# EAGLE design SmartWatch_System (EAGLE 9.7.0)
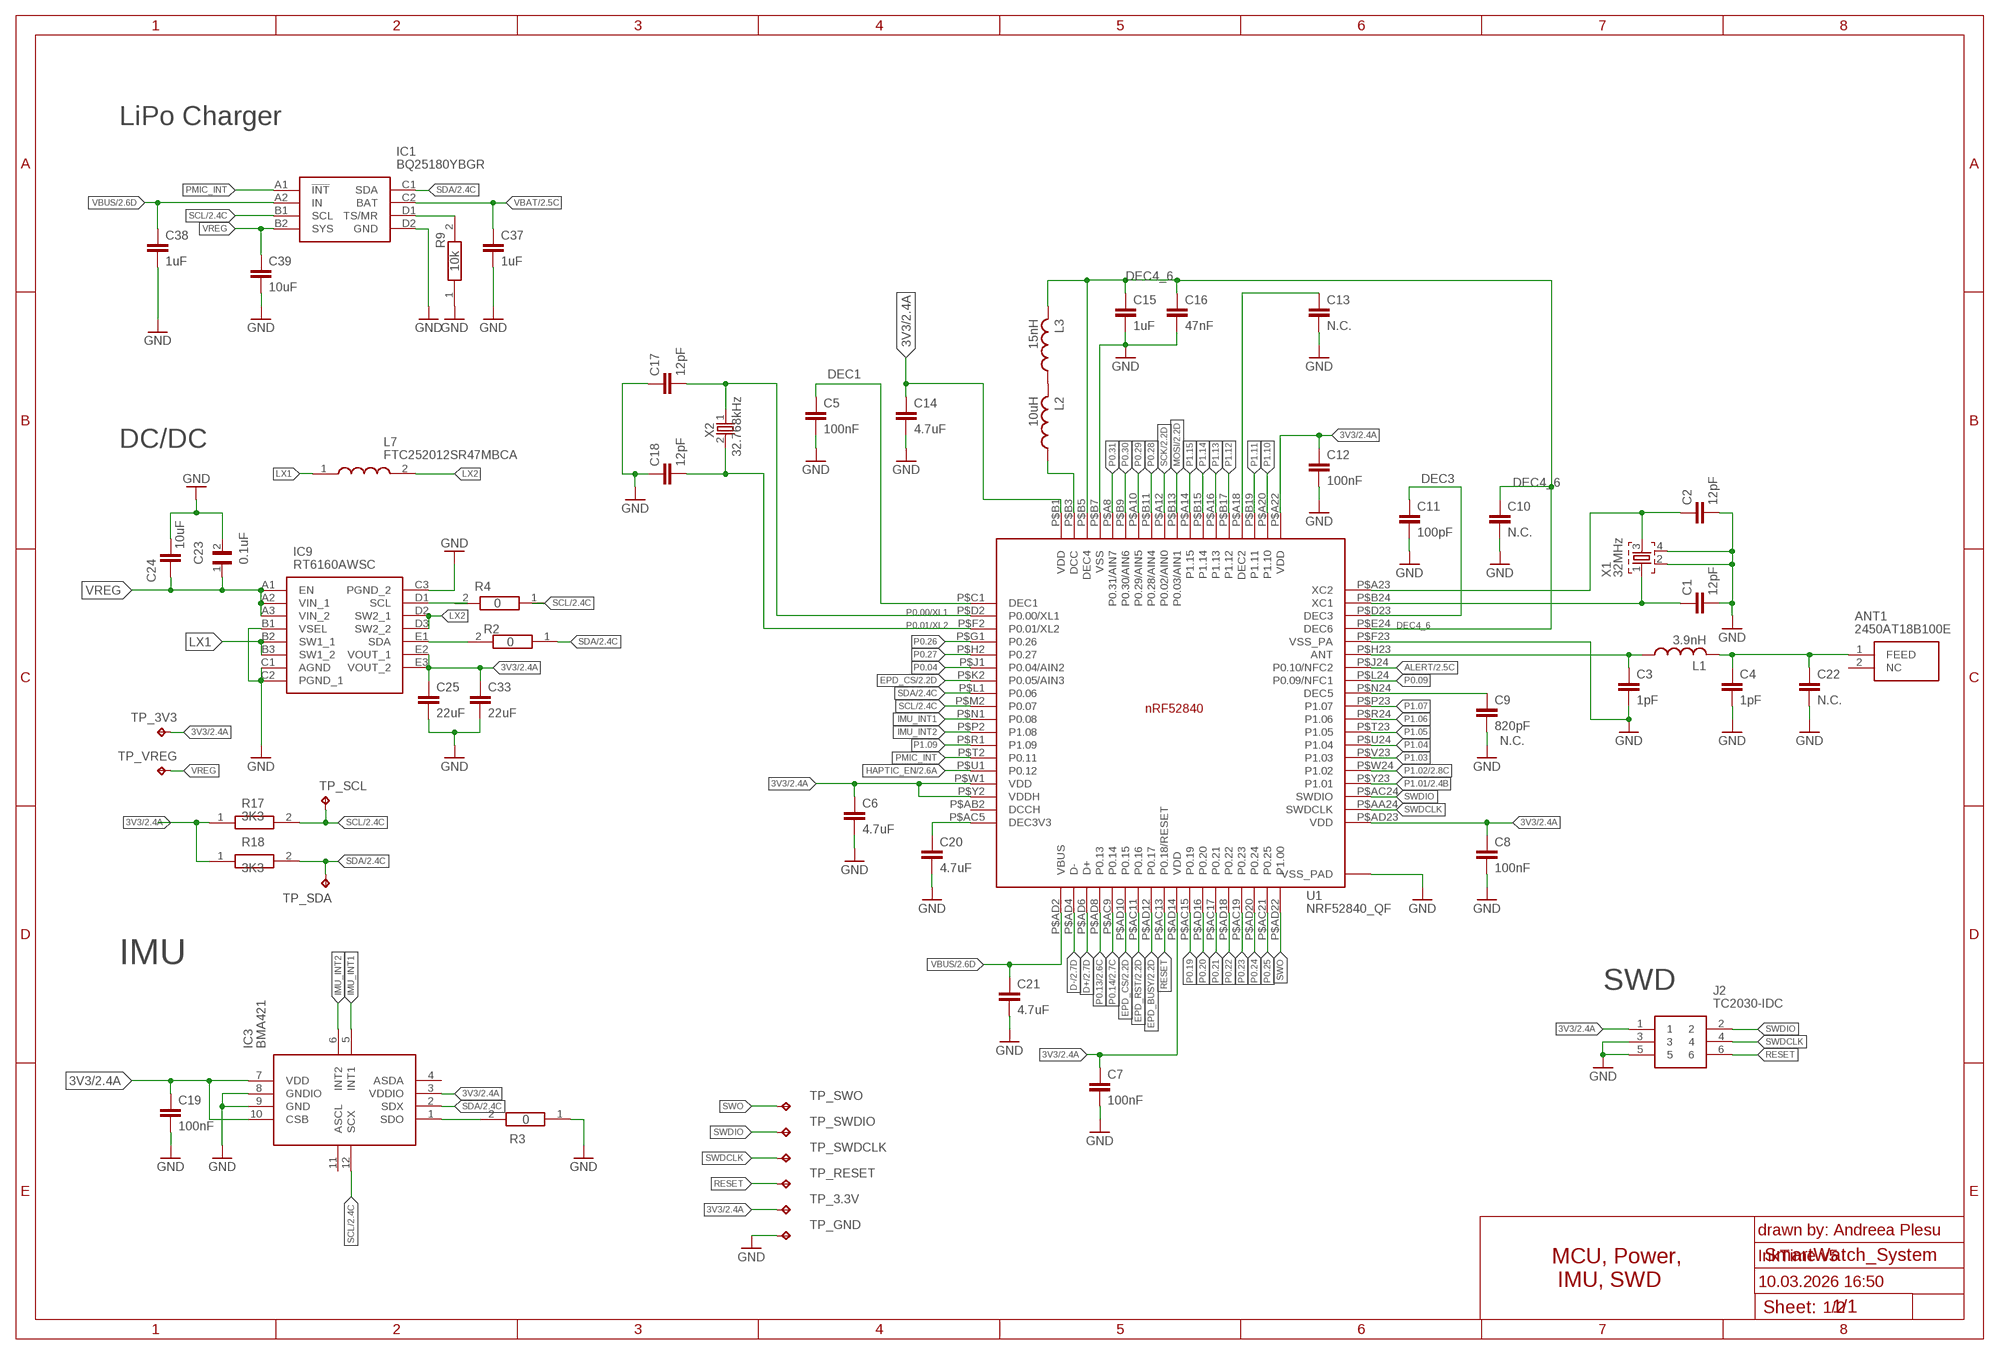
[diagram p0: schematic, sheet 1, part 1 of 2]
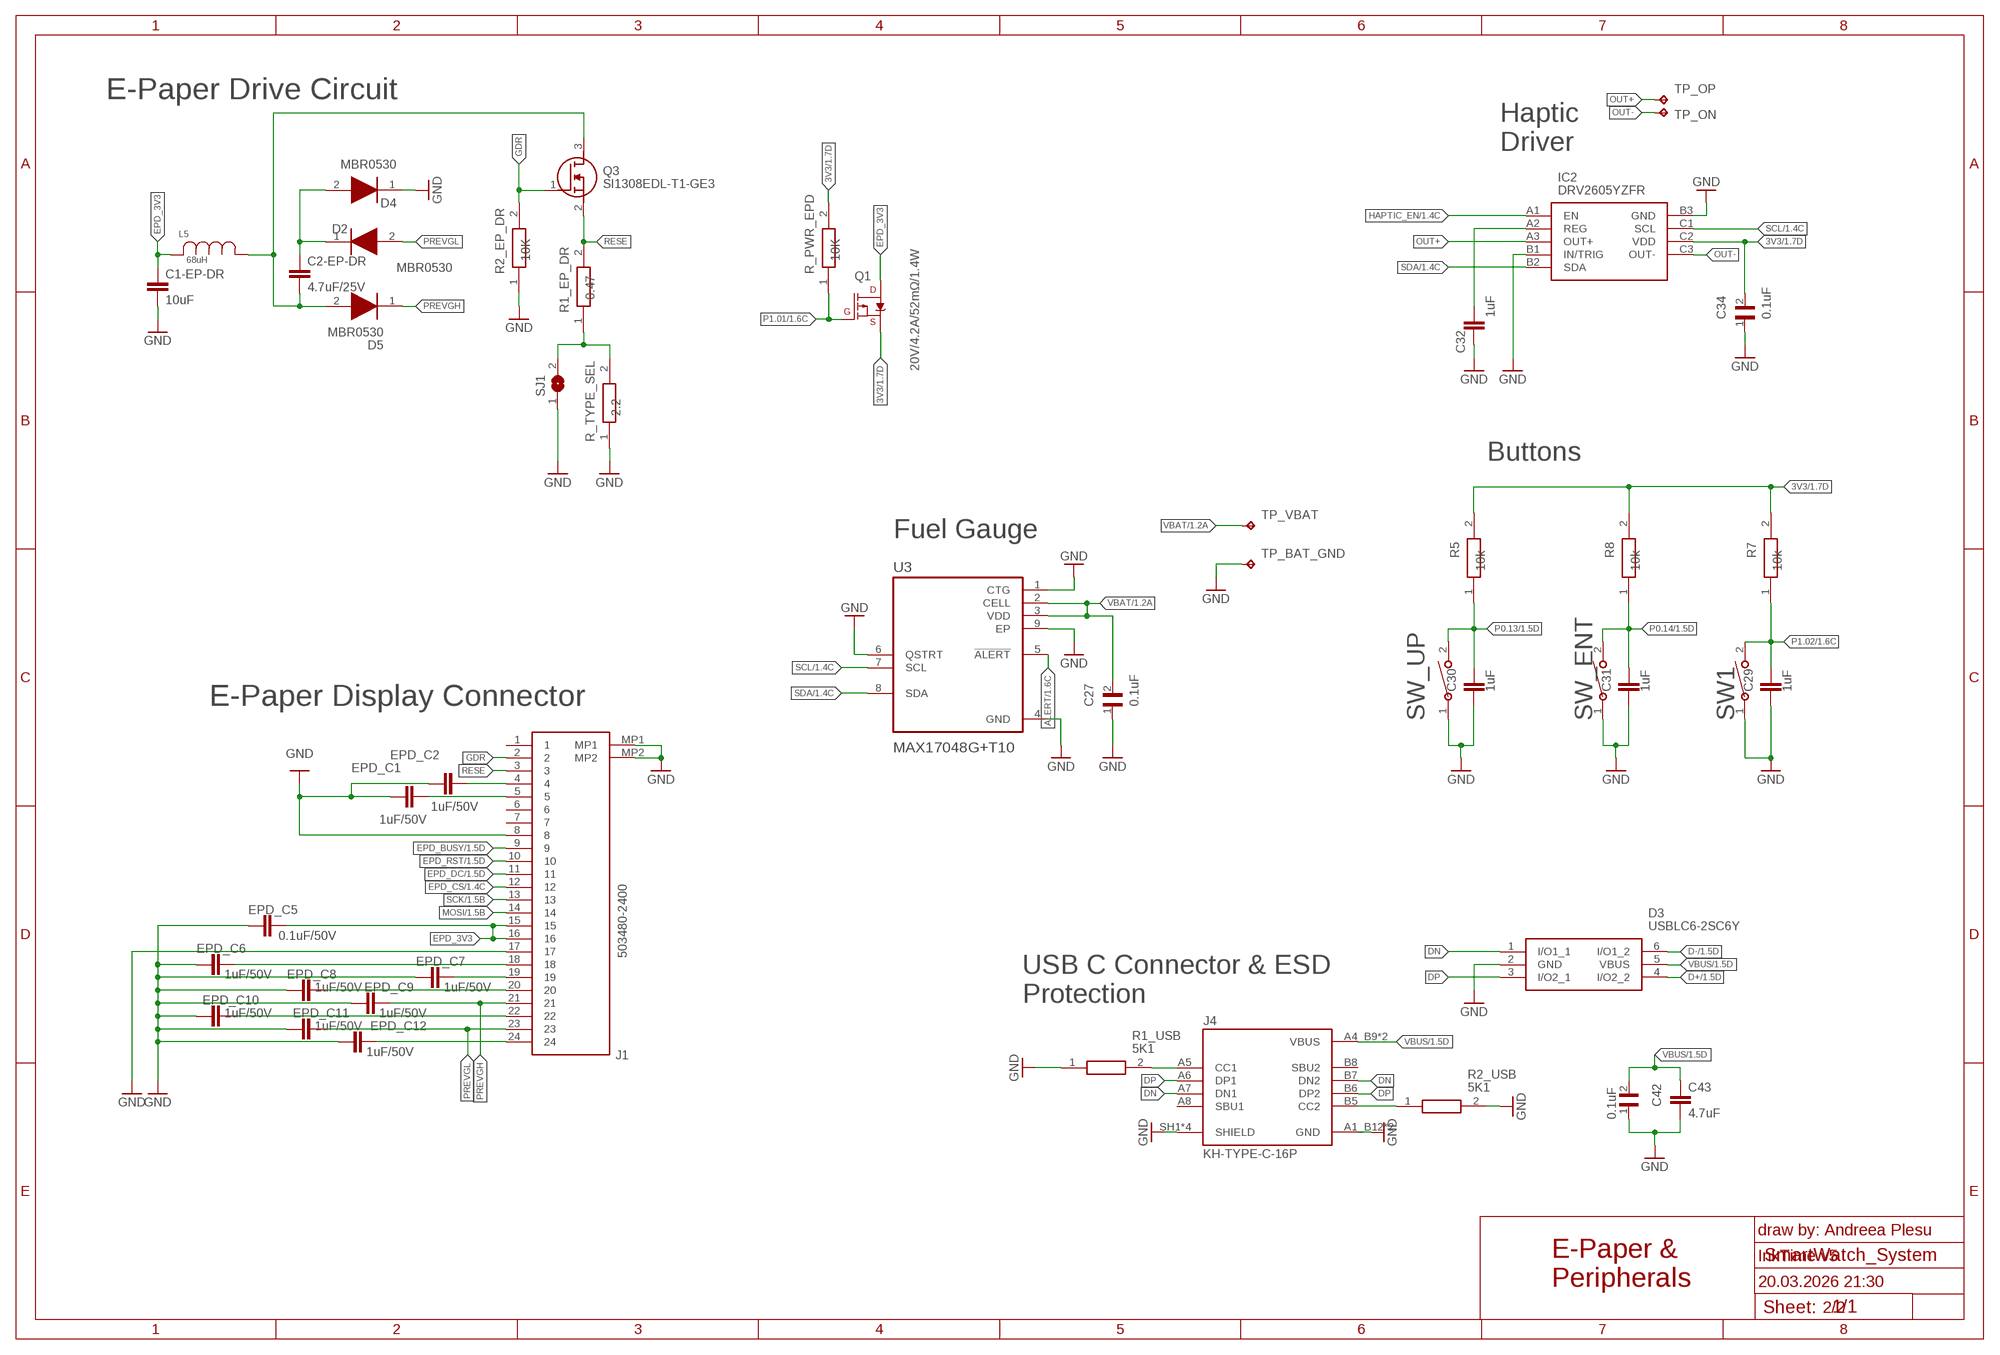
[diagram p1: schematic, sheet 1, part 2 of 2]

## Parts
ANT1  2450AT18B100E  2450AT18B100E_2450AT18B100E  [2450AT18B100E_ANTC3216X140N]
C1  12pF  NORDIC_NRF_3_CAPACITOR_0201_L  [NORDIC_NRF_3_RESC0201_L]
C1-EP-DR  10uF  NORDIC_NRF_3_CAPACITOR_0402_L  [NORDIC_NRF_3_RESC0402_L]
C2  12pF  NORDIC_NRF_3_CAPACITOR_0201_L  [NORDIC_NRF_3_RESC0201_L]
C2-EP-DR  4.7uF/25V  NORDIC_NRF_3_CAPACITOR_0402_L  [NORDIC_NRF_3_RESC0402_L]
C3  1pF  NORDIC_NRF_3_CAPACITOR_0201_L  [NORDIC_NRF_3_RESC0201_L]
C4  1pF  NORDIC_NRF_3_CAPACITOR_0201_L  [NORDIC_NRF_3_RESC0201_L]
C5  100nF  NORDIC_NRF_3_CAPACITOR_0201_L  [NORDIC_NRF_3_RESC0201_L]
C6  4.7uF  NORDIC_NRF_3_CAPACITOR_0402_L  [NORDIC_NRF_3_RESC0402_L]
C7  100nF  NORDIC_NRF_3_CAPACITOR_0201_L  [NORDIC_NRF_3_RESC0201_L]
C8  100nF  NORDIC_NRF_3_CAPACITOR_0201_L  [NORDIC_NRF_3_RESC0201_L]
C9  820pF  NORDIC_NRF_3_CAPACITOR_0201_L  [NORDIC_NRF_3_RESC0201_L]
C10  N.C.  NORDIC_NRF_3_CAPACITOR_0201_L  [NORDIC_NRF_3_RESC0201_L]
C11  100pF  NORDIC_NRF_3_CAPACITOR_0201_L  [NORDIC_NRF_3_RESC0201_L]
C12  100nF  NORDIC_NRF_3_CAPACITOR_0201_L  [NORDIC_NRF_3_RESC0201_L]
C13  N.C.  NORDIC_NRF_3_CAPACITOR_0201_L  [NORDIC_NRF_3_RESC0201_L]
C14  4.7uF  PERFECT_0402_CAP_0402  [PERFECT_0402_0402]
C15  1uF  PERFECT_0402_CAP_0402  [PERFECT_0402_0402]
C16  47nF  NORDIC_NRF_3_CAPACITOR_0201_L  [NORDIC_NRF_3_RESC0201_L]
C17  12pF  NORDIC_NRF_3_CAPACITOR_0201_L  [NORDIC_NRF_3_RESC0201_L]
C18  12pF  NORDIC_NRF_3_CAPACITOR_0201_L  [NORDIC_NRF_3_RESC0201_L]
C19  100nF  NORDIC_NRF_3_CAPACITOR_0201_L  [NORDIC_NRF_3_RESC0201_L]
C20  4.7uF  NORDIC_NRF_3_CAPACITOR_0402_L  [NORDIC_NRF_3_RESC0402_L]
C21  4.7uF  NORDIC_NRF_3_CAPACITOR_0402_L  [NORDIC_NRF_3_RESC0402_L]
C22  N.C.  NORDIC_NRF_3_CAPACITOR_0201_L  [NORDIC_NRF_3_RESC0201_L]
C23  0.1uF  GRM011R60J152KE01L_2_GRM011R60J152KE01L  [GRM011R60J152KE01L_2_CAPC0201X13N]
C24  10uF  PERFECT_0402_CAP_0402  [PERFECT_0402_0402]
C25  22uF  NORDIC_NRF_3_CAPACITOR_0402_L  [NORDIC_NRF_3_RESC0402_L]
C27  0.1uF  GRM011R60J152KE01L_2_GRM011R60J152KE01L  [GRM011R60J152KE01L_2_CAPC0201X13N]
C29  1uF  PERFECT_0402_CAP_0402  [PERFECT_0402_0402]
C30  1uF  PERFECT_0402_CAP_0402  [PERFECT_0402_0402]
C31  1uF  PERFECT_0402_CAP_0402  [PERFECT_0402_0402]
C32  1uF  NORDIC_NRF_3_CAPACITOR_0402_L  [NORDIC_NRF_3_RESC0402_L]
C33  22uF  NORDIC_NRF_3_CAPACITOR_0402_L  [NORDIC_NRF_3_RESC0402_L]
C34  0.1uF  GRM011R60J152KE01L_1_GRM011R60J152KE01L  [NORDIC_NRF_3_RESC0201_L]
C37  1uF  PERFECT_0402_CAP_0402  [PERFECT_0402_0402]
C38  1uF  PERFECT_0402_CAP_0402  [PERFECT_0402_0402]
C39  10uF  PERFECT_0402_CAP_0402  [PERFECT_0402_0402]
C42  0.1uF  GRM011R60J152KE01L_1_GRM011R60J152KE01L  [NORDIC_NRF_3_RESC0201_L]
C43  4.7uF  PERFECT_0402_CAP_0402  [PERFECT_0402_0402]
D2  MBR0530  ESP32_C6_LIBRARY_5_MBR0530  [ESP32_C6_LIBRARY_5_SOD3716X135N]
D3  USBLC6-2SC6Y  ESP32_C6_LIBRARY_3_USBLC6-2SC6Y  [ESP32_C6_LIBRARY_3_SOT95P280X145-6N]
D4  MBR0530  ESP32_C6_LIBRARY_5_MBR0530  [ESP32_C6_LIBRARY_5_SOD3716X135N]
D5  MBR0530  ESP32_C6_LIBRARY_5_MBR0530  [ESP32_C6_LIBRARY_5_SOD3716X135N]
EPD_C1  1uF/50V  NORDIC_NRF_3_CAPACITOR_0402_L  [NORDIC_NRF_3_RESC0402_L]
EPD_C2  1uF/50V  NORDIC_NRF_3_CAPACITOR_0402_L  [NORDIC_NRF_3_RESC0402_L]
EPD_C5  0.1uF/50V  NORDIC_NRF_3_CAPACITOR_0201_L  [NORDIC_NRF_3_RESC0201_L]
EPD_C6  1uF/50V  NORDIC_NRF_3_CAPACITOR_0402_L  [NORDIC_NRF_3_RESC0402_L]
EPD_C7  1uF/50V  NORDIC_NRF_3_CAPACITOR_0402_L  [NORDIC_NRF_3_RESC0402_L]
EPD_C8  1uF/50V  NORDIC_NRF_3_CAPACITOR_0402_L  [NORDIC_NRF_3_RESC0402_L]
EPD_C9  1uF/50V  NORDIC_NRF_3_CAPACITOR_0402_L  [NORDIC_NRF_3_RESC0402_L]
EPD_C10  1uF/50V  NORDIC_NRF_3_CAPACITOR_0402_L  [NORDIC_NRF_3_RESC0402_L]
EPD_C11  1uF/50V  NORDIC_NRF_3_CAPACITOR_0402_L  [NORDIC_NRF_3_RESC0402_L]
EPD_C12  1uF/50V  NORDIC_NRF_3_CAPACITOR_0402_L  [NORDIC_NRF_3_RESC0402_L]
IC1  BQ25180YBGR  BQ25180YBGR_BQ25180YBGR  [BQ25180YBGR_BGA8C40P2X4_100X155X50]
IC2  DRV2605YZFR  DRV2605YZFR_DRV2605YZFR  [DRV2605YZFR_BGA9C50P3X3_144X144X62]
IC3  BMA421  BMA423_BMA423  [BMA423_BMA423]
IC9  RT6160AWSC  RT6160AWSC_RT6160AWSC  [RT6160AWSC_BGA15C40P3X5_140X230X60]
J1  503480-2400  503480-2400_503480-2400  [503480-2400_5034802400]
J2  TC2030-IDC  TC2030-IDC_TC2030-IDC  [TC2030-IDC_TC2030IDC]
J4  KH-TYPE-C-16P  KH-TYPE-C-16P_KH-TYPE-C-16P  [KH-TYPE-C-16P_KINGHELM_KH-TYPE-C-16P]
L1  3.9nH  NORDIC_NRF_2_INDUCTOR_0402_L  [NORDIC_NRF_2_RESC0402_L]
L2  10uH  NORDIC_NRF_2_INDUCTOR_0402_L  [NORDIC_NRF_2_RESC0402_L]
L3  15nH  NORDIC_NRF_2_INDUCTOR_0402_L  [NORDIC_NRF_2_RESC0402_L]
L5  68uH  ESP32_C6_LIBRARY_2_744043680IND_4828-WE-TPC_WRE  [ESP32_C6_LIBRARY_2_IND_4828-WE-TPC_WRE]
L7  FTC252012SR47MBCA  MLP2016SR47MT0S1_FTC252012SR47MBCA  [MLP2016SR47MT0S1_INDC2016X100N]
Q1  20V/4.2A/52mΩ/1.4W  ESP32_C6_LIBRARY_4_ESP32_WROVER_SPARKFUN-DISCRETESEMI_MOSFET_PCH-DMG2305UX-7  [ESP32_C6_LIBRARY_4_ESP32_C6_LIBRARY_4_ESP32_C6_LIBRARY_4_ESP32_C6_LIBRARY_4_ESP32_WROVER_SPARKFUN-DISCRETESEMI_SOT23-3]
Q3  SI1308EDL-T1-GE3  ESP32_C6_LIBRARY_6_SI1308EDL-T1-GE3  [ESP32_C6_LIBRARY_6_SOT65P210X110-3N]
R1_EP_DR  0.47  CPF0201D7K68C1_CPF0201D7K68C1  [CPF0201D7K68C1_0201]
R1_USB  5K1  CPF0201D7K68C1_CPF0201D7K68C1  [CPF0201D7K68C1_0201]
R2  0  ERA-1AEB3401C_CPF0201D7K68C1  [ERA-1AEB3401C_0201]
R2_EP_DR  10K  CPF0201D7K68C1_CPF0201D7K68C1  [CPF0201D7K68C1_0201]
R2_USB  5K1  CPF0201D7K68C1_CPF0201D7K68C1  [CPF0201D7K68C1_0201]
R3  0  CPF0201D7K68C1_CPF0201D7K68C1  [CPF0201D7K68C1_0201]
R4  0  ERA-1AEB3401C_CPF0201D7K68C1  [ERA-1AEB3401C_0201]
R5  10k  CPF0201D7K68C1_CPF0201D7K68C1  [CPF0201D7K68C1_0201]
R7  10k  CPF0201D7K68C1_CPF0201D7K68C1  [CPF0201D7K68C1_0201]
R8  10k  CPF0201D7K68C1_CPF0201D7K68C1  [CPF0201D7K68C1_0201]
R9  10k  ERA-1AEB3401C_CPF0201D7K68C1  [ERA-1AEB3401C_0201]
R17  3K3  ERA-1AEB3401C_CPF0201D7K68C1  [ERA-1AEB3401C_0201]
R18  3K3  ERA-1AEB3401C_CPF0201D7K68C1  [ERA-1AEB3401C_0201]
R_PWR_EPD  10K  CPF0201D7K68C1_CPF0201D7K68C1  [CPF0201D7K68C1_0201]
R_TYPE_SEL  2.2  CPF0201D7K68C1_CPF0201D7K68C1  [CPF0201D7K68C1_0201]
SJ1  ESP32_C6_LIBRARY_7_JUMPER_SJ  [ESP32_C6_LIBRARY_7_JUMPER_SJ]
SW1  2025-10-22_07-23-44_LIBRARY_EVP-AKE31ASW_EVP-AKE31A_PAN  [2025-10-22_07-23-44_LIBRARY_SW_EVP-AKE31A_PAN]
SW_ENT  2025-10-22_07-23-44_LIBRARY_EVP-AKE31ASW_EVP-AKE31A_PAN  [2025-10-22_07-23-44_LIBRARY_SW_EVP-AKE31A_PAN]
SW_UP  2025-10-22_07-23-44_LIBRARY_EVP-AKE31ASW_EVP-AKE31A_PAN  [2025-10-22_07-23-44_LIBRARY_SW_EVP-AKE31A_PAN]
TP_3.3V  HECTOR_WATCH_1_TPTP20R  [HECTOR_WATCH_1_TP20R]
TP_3V3  HECTOR_WATCH_1_TPTP20R  [HECTOR_WATCH_1_TP20R]
TP_BAT_GND  HECTOR_WATCH_1_TPTP20R  [HECTOR_WATCH_1_TP20R]
TP_GND  HECTOR_WATCH_1_TPTP20R  [HECTOR_WATCH_1_TP20R]
TP_ON  HECTOR_WATCH_1_TPTP20R  [HECTOR_WATCH_1_TP20R]
TP_OP  HECTOR_WATCH_1_TPTP20R  [HECTOR_WATCH_1_TP20R]
TP_RESET  HECTOR_WATCH_1_TPTP20R  [HECTOR_WATCH_1_TP20R]
TP_SCL  HECTOR_WATCH_1_TPTP20R  [HECTOR_WATCH_1_TP20R]
TP_SDA  HECTOR_WATCH_1_TPTP20R  [HECTOR_WATCH_1_TP20R]
TP_SWDCLK  HECTOR_WATCH_1_TPTP20R  [HECTOR_WATCH_1_TP20R]
TP_SWDIO  HECTOR_WATCH_1_TPTP20R  [HECTOR_WATCH_1_TP20R]
TP_SWO  HECTOR_WATCH_1_TPTP20R  [HECTOR_WATCH_1_TP20R]
TP_VBAT  HECTOR_WATCH_1_TPTP20R  [HECTOR_WATCH_1_TP20R]
TP_VREG  HECTOR_WATCH_1_TPTP20R  [HECTOR_WATCH_1_TP20R]
U1  NRF52840_QF  NORDIC_NRF_4_NRF52840_QF  [NORDIC_NRF_4_AQFN50P700X700X85_HS-74N]
U3  MAX17048G+T10  ESP32_C6_LIBRARY_MAX17048G+T10  [ESP32_C6_LIBRARY_SON50P200X200X80-9N]
X1  32MHz  NORDIC_NRF_XTAL_32MHZ  [NORDIC_NRF_BT-XTAL_2016_N]
X2  32.768kHz  NORDIC_NRF_1_XTAL_32KHZ  [NORDIC_NRF_1_XTAL_3215_N]

## Nets
3V3/1.7D [POWER]: C34.2 IC2.C2(VDD) Q1.2(S) R5.2 R7.2 R8.2 R_PWR_EPD.2
3V3/2.4A [POWER]: C6.1 C7.1 C8.1 C12.1 C14.1 C19.1 C25.1 C33.1 IC3.3(VDDIO) IC3.7(VDD) IC3.10(CSB) IC9.E2(VOUT_1) IC9.E3(VOUT_2) J2.1 R17.1 R18.1 TP_3.3V.TP TP_3V3.TP U1.P$A22(VDD) U1.P$AD14(VDD) U1.P$AD23(VDD) U1.P$B1(VDD) U1.P$W1(VDD) U1.P$Y2(VDDH)
ALERT/1.6C: U3.5(!ALERT)
ALERT/2.5C: U1.P$J24(P0.10/NFC2)
D+/1.5D: D3.4(I/O2_2)
D+/2.7D: U1.P$AD6(D+)
D-/1.5D: D3.6(I/O1_2)
D-/2.7D: U1.P$AD4(D-)
DEC1: C5.1 U1.P$C1(DEC1)
DEC3: C11.1 U1.P$D23(DEC3)
DEC4_6: C10.1 C15.1 C16.1 L3.2 U1.P$B5(DEC4) U1.P$E24(DEC6)
DN: D3.1(I/O1_1) J4.A7(DN1) J4.B7(DN2)
DP: D3.3(I/O2_1) J4.A6(DP1) J4.B6(DP2)
EPD_3V3: C1-EP-DR.1 EPD_C5.2 J1.15 J1.16 L5.2 Q1.3(D)
EPD_BUSY/1.5D: J1.9
EPD_BUSY/2.2D: U1.P$AD12(P0.17)
EPD_CS/1.4C: J1.12
EPD_CS/2.2D: U1.P$AD10(P0.15) U1.P$K2(P0.05/AIN3)
EPD_DC/1.5D: J1.11
EPD_RST/1.5D: J1.10
EPD_RST/2.2D: U1.P$AC11(P0.16)
GDR: J1.2 Q3.1(G) R2_EP_DR.2
GND: C1-EP-DR.2 C1.2 C2.2 C3.2 C4.2 C5.2 C6.2 C7.2 C8.2 C9.2 C10.2 C11.2 C12.2 C13.2 C14.2 C15.2 C16.2 C17.1 C18.1 C19.2 C20.2 C21.2 C22.2 C23.2 C24.2 C25.2 C27.1 C29.2 C30.2 C31.2 C32.2 C33.2 C34.1 C37.2 C38.2 C39.2 C42.1 C43.2 D3.2(GND) D4.1(K) EPD_C1.1 EPD_C2.1 EPD_C5.1 EPD_C6.1 EPD_C7.1 EPD_C8.1 EPD_C9.1 EPD_C10.1 EPD_C11.1 EPD_C12.1 IC1.D2(GND) IC2.B1(IN/TRIG) IC2.B3(GND) IC3.8(GNDIO) IC3.9(GND) IC9.B1(VSEL) IC9.C1(AGND) IC9.C2(PGND_1) IC9.C3(PGND_2) J1.8 J1.17 J1.MP1 J1.MP2 J2.3 J2.5 J4.A1_B12(GND) J4.A12_B1(GND) J4.SH1(SHIELD) J4.SH2(SHIELD) J4.SH3(SHIELD) J4.SH4(SHIELD) R1_USB.1 R2_EP_DR.1 R2_USB.2 R3.1 R9.1 R_TYPE_SEL.1 SJ1.1 SW1.1 SW_ENT.1 SW_UP.1 TP_BAT_GND.TP TP_GND.TP U1.P$74(VSS_PAD) U1.P$75(VSS_PAD) U1.P$76(VSS_PAD) U1.P$77(VSS_PAD) U1.P$78(VSS_PAD) U1.P$79(VSS_PAD) U1.P$80(VSS_PAD) U1.P$81(VSS_PAD) U1.P$82(VSS_PAD) U1.P$83(VSS_PAD) U1.P$84(VSS_PAD) U1.P$85(VSS_PAD) U1.P$86(VSS_PAD) U1.P$87(VSS_PAD) U1.P$88(VSS_PAD) U1.P$89(VSS_PAD) U1.P$90(VSS_PAD) U1.P$B7(VSS) U1.P$F23(VSS_PA) U3.1(CTG) U3.4(GND) U3.6(QSTRT) U3.9(EP) X1.2 X1.4
HAPTIC_EN/1.4C: IC2.A1(EN)
HAPTIC_EN/2.6A: U1.P$U1(P0.12)
IMU_INT1: IC3.5(INT1) U1.P$N1(P0.08)
IMU_INT2: IC3.6(INT2) U1.P$P2(P1.08)
LX1: IC9.B2(SW1_1) IC9.B3(SW1_2) L7.1
LX2: IC9.D2(SW2_1) IC9.D3(SW2_2) L7.2
MOSI/1.5B: J1.14
MOSI/2.2D: U1.P$B13(P0.03/AIN1)
N$1: IC1.D1(TS/MR) R9.2
N$2: IC9.D1(SCL) R4.2
N$3: IC9.E1(SDA) R2.2
N$4: L2.2 L3.1
N$6: L2.1 U1.P$B3(DCC)
N$7: IC3.1(SDO) R3.2
N$9: C13.1 U1.P$A18(DEC2)
N$10: C17.2 U1.P$D2(P0.00/XL1) X2.1
N$11: C18.2 U1.P$F2(P0.01/XL2) X2.2
N$12: C20.1 U1.P$AC5(DEC3V3)
N$14: C1.1 U1.P$B24(XC1) X1.1
N$15: C2.1 U1.P$A23(XC2) X1.3
N$16: C9.1 U1.P$N24(DEC5)
N$17: C3.1 L1.1 U1.P$H23(ANT)
N$18: ANT1.1(FEED) C4.1 C22.1 L1.2
N$19: C2-EP-DR.1 D2.1(K) D4.2(A)
N$20: C2-EP-DR.2 D5.2(A) L5.1 Q3.3(D)
N$21: R1_EP_DR.1 R_TYPE_SEL.2 SJ1.2
N$22: EPD_C2.2 J1.4
N$23: EPD_C1.2 J1.5
N$24: EPD_C6.2 J1.18
N$25: EPD_C7.2 J1.19
N$26: EPD_C8.2 J1.20
N$27: C32.1 IC2.A2(REG)
N$28: EPD_C10.2 J1.22
N$29: J4.B5(CC2) R2_USB.1
N$30: EPD_C12.2 J1.24
N$31: J4.A5(CC1) R1_USB.2
OUT+: IC2.A3(OUT+) TP_OP.TP
OUT-: IC2.C3(OUT-) TP_ON.TP
P0.04: U1.P$J1(P0.04/AIN2)
P0.09: U1.P$L24(P0.09/NFC1)
P0.13/1.5D: C30.1 R5.1 SW_UP.2
P0.13/2.6C: U1.P$AD8(P0.13)
P0.14/1.5D: C31.1 R8.1 SW_ENT.2
P0.14/2.7C: U1.P$AC9(P0.14)
P0.19: U1.P$AC15(P0.19)
P0.20: U1.P$AD16(P0.20)
P0.21: U1.P$AC17(P0.21)
P0.22: U1.P$AD18(P0.22)
P0.23: U1.P$AC19(P0.23)
P0.24: U1.P$AD20(P0.24)
P0.25: U1.P$AC21(P0.25)
P0.26: U1.P$G1(P0.26)
P0.27: U1.P$H2(P0.27)
P0.28: U1.P$B11(P0.28/AIN4)
P0.29: U1.P$A10(P0.29/AIN5)
P0.30: U1.P$B9(P0.30/AIN6)
P0.31: U1.P$A8(P0.31/AIN7)
P1.01/1.6C: Q1.1(G) R_PWR_EPD.1
P1.01/2.4B: U1.P$Y23(P1.01)
P1.02/1.6C: C29.1 R7.1 SW1.2
P1.02/2.8C: U1.P$W24(P1.02)
P1.03: U1.P$V23(P1.03)
P1.04: U1.P$U24(P1.04)
P1.05: U1.P$T23(P1.05)
P1.06: U1.P$R24(P1.06)
P1.07: U1.P$P23(P1.07)
P1.09: U1.P$R1(P1.09)
P1.10: U1.P$A20(P1.10)
P1.11: U1.P$B19(P1.11)
P1.12: U1.P$B17(P1.12)
P1.13: U1.P$A16(P1.13)
P1.14: U1.P$B15(P1.14)
P1.15: U1.P$A14(P1.15)
PMIC_INT: IC1.A1(!INT) U1.P$T2(P0.11)
PREVGH: D5.1(K) EPD_C9.2 J1.21
PREVGL: D2.2(A) EPD_C11.2 J1.23
RESE: J1.3 Q3.2(S) R1_EP_DR.2
RESET: J2.6 TP_RESET.TP U1.P$AC13(P0.18/RESET)
SCK/1.5B: J1.13
SCK/2.2D: U1.P$A12(P0.02/AIN0)
SCL/1.4C: IC2.C1(SCL) U3.7(SCL)
SCL/2.4C: IC1.B1(SCL) IC3.12(SCX) R4.1 R17.2 TP_SCL.TP U1.P$M2(P0.07)
SDA/1.4C: IC2.B2(SDA) U3.8(SDA)
SDA/2.4C: IC1.C1(SDA) IC3.2(SDX) R2.1 R18.2 TP_SDA.TP U1.P$L1(P0.06)
SWDCLK: J2.4 TP_SWDCLK.TP U1.P$AA24(SWDCLK)
SWDIO: J2.2 TP_SWDIO.TP U1.P$AC24(SWDIO)
SWO: TP_SWO.TP U1.P$AD22(P1.00)
VBAT/1.2A [POWER]: C27.2 TP_VBAT.TP U3.2(CELL) U3.3(VDD)
VBAT/2.5C [POWER]: C37.1 IC1.C2(BAT)
VBUS/1.5D [POWER]: C42.2 C43.1 D3.5(VBUS) J4.A4_B9(VBUS) J4.A9_B4(VBUS)
VBUS/2.6D [POWER]: C21.1 C38.1 IC1.A2(IN) U1.P$AD2(VBUS)
VREG [POWER]: C23.1 C24.1 C39.1 IC1.B2(SYS) IC9.A1(EN) IC9.A2(VIN_1) IC9.A3(VIN_2) TP_VREG.TP
Unconnected: ANT1.2(NC) IC3.4(ASDA) IC3.11(ASCL) J1.1 J1.6 J1.7 J4.A8(SBU1) J4.B8(SBU2) U1.P$AB2(DCCH)

## Notes on the sheet
- LiPo Charger
- DC/DC
- DEC4_6
- P0.00/XL1
- P0.01/XL2 | DEC4_6
- N.C.
- IMU
- SWD
- drawn by: Andreea Plesu
- InkTime v5
- MCU, Power,
   IMU, SWD
- 10.03.2026 16:50
- 1/2
- E-Paper Drive Circuit
- Haptic
  Driver
- Buttons
- Fuel Gauge
- E-Paper Display Connector
- USB C Connector & ESD
  Protection
- draw by: Andreea Plesu
- InkTime v5
- E-Paper &
  Peripherals
- 20.03.2026 21:30
- 2/2

## Library data of the parts
ANT1 = InkTime_v5:2450AT18B100E_2450AT18B100E: Antennas 2.45GHz ANTENNA Source: Datasheet <https://www.johansontechnology.com/datasheets/2450AT18B100/2450AT18B100.pdf>; ARROW_PART_NUMBER: 2450AT18B100E; ARROW_PRICE-STOCK: https://www.arrow.com/en/products/2450at18b100e/johanson-dielectrics?utm_currency=USD&region=nac; DESCRIPTION: Antennas 2.45GHz ANTENNA; HEIGHT: 1.4mm; MANUFACTURER_NAME: JOHANSON TECHNOLOGY; MANUFACTURER_PART_NUMBER: 2450AT18B100E; MOUSER_PART_NUMBER: 609-2450AT18B100E; MOUSER_PRICE-STOCK: https://www.mouser.co.uk/ProductDetail/Johanson-Technology/2450AT18B100E?qs=yCnrNFeXz%252Bh5MFsFIXGZGA%3D%3D
C1 C1-EP-DR C2 C2-EP-DR C3-C13 C16-C22 C25 C32 C33 EPD_C1 EPD_C2 EPD_C5-EPD_C12 = InkTime_v5:NORDIC_NRF_3_CAPACITOR: Generic chip capacitor
C14 C15 C24 C29-C31 C37-C39 C43 = InkTime_v5:PERFECT_0402_CAP_0402: 0402 (1005 Metric) Nick Garner - TeleSense
C23 C27 = InkTime_v5:GRM011R60J152KE01L_2_GRM011R60J152KE01L: Check availability <https://pricing.snapeda.com/parts/GRM011R60J152KE01L/Murata/view-part?ref=eda>; AVAILABILITY: In Stock; CHECK_PRICES: https://www.snapeda.com/parts/GRM011R60J152KE01L/Murata/view-part/?ref=eda; DESCRIPTION: SMD Capacitor X5R(EIA) with Capacitance: 1500pF Tol. 10%. Rated Voltage: 6.3Vdc; MF: Murata; MP: GRM011R60J152KE01L; PACKAGE: 0201 Murata; PRICE: None; SNAPEDA_LINK: https://www.snapeda.com/parts/GRM011R60J152KE01L/Murata/view-part/?ref=snap
C34 C42 = InkTime_v5:GRM011R60J152KE01L_1_GRM011R60J152KE01L: Check availability <https://pricing.snapeda.com/parts/GRM011R60J152KE01L/Murata/view-part?ref=eda>
D2 D4 D5 = InkTime_v5:ESP32_C6_LIBRARY_5_MBR0530: ON SEMICONDUCTOR - MBR0530 - DIODE, SCHOTTKY, 0.5A, 30V, SOD-123 Source: Datasheet <http://www.onsemi.com/pub/Collateral/MBR0530T1-D.PDF> Check availability <https://pricing.snapeda.com/parts/MBR0530/ON%20Semiconductor/view-part?ref=eda>; AVAILABILITY: In Stock; CHECK_PRICES: https://www.snapeda.com/parts/MBR0530/Onsemi/view-part/?ref=eda; DESCRIPTION: Diode Schottky 30 V 500mA Surface Mount SOD-123; MF: ON Semiconductor; MP: MBR0530; PACKAGE: SOD-123-2 ON Semiconductor; PRICE: None; PURCHASE-URL: https://www.snapeda.com/api/url_track_click_mouser/?unipart_id=179458&manufacturer=ON Semiconductor&part_name=MBR0530&search_term=None; SNAPEDA_LINK: https://www.snapeda.com/parts/MBR0530/Onsemi/view-part/?ref=snap
D3 = InkTime_v5:ESP32_C6_LIBRARY_3_USBLC6-2SC6Y: Low Cap. ESD Protection Auto SOT-23-6 STMicroelectronics USBLC6-2SC6Y, Dual Uni-Directional TVS Diode Array, 6-Pin SOT-23 Source: Datasheet <https://componentsearchengine.com/Datasheets/1/USBLC6-2SC6Y.pdf> Check availability <https://pricing.snapeda.com/parts/USBLC6-2SC6Y/STMicroelectronics/view-part?ref=eda>; AVAILABILITY: In Stock; CHECK_PRICES: https://www.snapeda.com/parts/USBLC6-2SC6Y/STMicroelectronics/view-part/?ref=eda; DESCRIPTION: 17V Clamp 5A (8/20µs) Ipp Tvs Diode Surface Mount SOT-23-6; MF: STMicroelectronics; MP: USBLC6-2SC6Y; PACKAGE: SOT-23-6 STMicroelectronics; PRICE: None; SNAPEDA_LINK: https://www.snapeda.com/parts/USBLC6-2SC6Y/STMicroelectronics/view-part/?ref=snap
IC1 = InkTime_v5:BQ25180YBGR_BQ25180YBGR: Charger IC Lithium Ion/Polymer, Lithium Iron Phosphate 8-DSBGA (1.6x1.1) Source: Datasheet <https://www.ti.com/lit/ds/symlink/bq25180.pdf?ts=1650264094470&ref_url=https%3A%2F%2Fwww.ti.com%2Fproduct%2FBQ25180>; ARROW_PART_NUMBER: BQ25180YBGR; ARROW_PRICE-STOCK: https://www.arrow.com/en/products/bq25180ybgr/texas-instruments?utm_currency=USD&region=nac; DESCRIPTION: Charger IC Lithium Ion/Polymer, Lithium Iron Phosphate 8-DSBGA (1.6x1.1); HEIGHT: 0.5mm; MANUFACTURER_NAME: Texas Instruments; MANUFACTURER_PART_NUMBER: BQ25180YBGR; MOUSER_PART_NUMBER: 595-BQ25180YBGR; MOUSER_PRICE-STOCK: https://www.mouser.co.uk/ProductDetail/Texas-Instruments/BQ25180YBGR?qs=doiCPypUmgEWjAK%252BJAX6Tw%3D%3D
IC2 = InkTime_v5:DRV2605YZFR_DRV2605YZFR: Haptic Driver for ERM/LRA with Built-In Library and Smart Loop Architecture Source: Datasheet <http://www.ti.com/lit/gpn/drv2605>; ARROW_PART_NUMBER: DRV2605YZFR; ARROW_PRICE-STOCK: https://www.arrow.com/en/products/drv2605yzfr/texas-instruments?region=nac; DESCRIPTION: Haptic Driver for ERM/LRA with Built-In Library and Smart Loop Architecture; HEIGHT: 0.625mm; MANUFACTURER_NAME: Texas Instruments; MANUFACTURER_PART_NUMBER: DRV2605YZFR
IC3 = InkTime_v5:BMA423_BMA423: Accelerometers Triaxial low-g 12bit Acceleration Sensor Source: Datasheet <https://www.mouser.com/datasheet/2/783/BST-BMA423-DS000-1509600.pdf>; ARROW_PART_NUMBER: BMA423; ARROW_PRICE-STOCK: https://www.arrow.com/en/products/bma423/bosch; DESCRIPTION: Accelerometers Triaxial low-g 12bit Acceleration Sensor; HEIGHT: 1mm; MANUFACTURER_NAME: BOSCH; MANUFACTURER_PART_NUMBER: BMA423; MOUSER_PART_NUMBER: 262-BMA423; MOUSER_PRICE-STOCK: https://www.mouser.co.uk/ProductDetail/Bosch-Sensortec/BMA423?qs=HXFqYaX1Q2xC%252BSgeGoX3mg%3D%3D
IC9 = InkTime_v5:RT6160AWSC_RT6160AWSC: Buck-Boost Regulator Positive Output Step-Up/Step-Down I2C DC-DC Controller IC 15-WL-CSP (BSC) (1.4x2.3) Source: Datasheet <https://www.richtek.com/SaveDownload.aspx?specid=RT6160A>; DESCRIPTION: Buck-Boost Regulator Positive Output Step-Up/Step-Down I2C DC-DC Controller IC 15-WL-CSP (BSC) (1.4x2.3); HEIGHT: 0.6mm; MANUFACTURER_NAME: RICHTEK; MANUFACTURER_PART_NUMBER: RT6160AWSC; MOUSER_PART_NUMBER: 835-RT6160AWSC; MOUSER_PRICE-STOCK: https://www.mouser.co.uk/ProductDetail/Richtek/RT6160AWSC?qs=amGC7iS6iy%2FLd9PSoixZXQ%3D%3D
J1 = InkTime_v5:503480-2400_503480-2400: FFC & FPC Connectors 0.5mm FPC RA SMT Dual Contact 24Ckt Source: Datasheet <https://componentsearchengine.com/Datasheets/1/503480-2400.pdf>; DESCRIPTION: FFC & FPC Connectors 0.5mm FPC RA SMT Dual Contact 24Ckt; HEIGHT: 1.87mm; MANUFACTURER_NAME: Molex; MANUFACTURER_PART_NUMBER: 503480-2400; MOUSER_PART_NUMBER: 538-503480-2400; MOUSER_PRICE-STOCK: https://www.mouser.co.uk/ProductDetail/Molex/503480-2400?qs=OAhjpuo3Vu7efIoxFh9AOw%3D%3D
J2 = InkTime_v5:TC2030-IDC_TC2030-IDC: CABLE ADAPTER 6 POS Source: Datasheet <https://datasheet.datasheetarchive.com/originals/distributors/Datasheets_SAMA/62bc384e093448baaaa63dbd0b9d8707.pdf>; DESCRIPTION: CABLE ADAPTER 6 POS; HEIGHT: 19mm; MANUFACTURER_NAME: Tag Connect; MANUFACTURER_PART_NUMBER: TC2030-IDC
J4 = InkTime_v5:KH-TYPE-C-16P_KH-TYPE-C-16P: Check availability <https://pricing.snapeda.com/parts/KH-TYPE-C-16P/kinghelm/view-part?ref=eda>; AVAILABILITY: Not in stock; CHECK_PRICES: https://www.snapeda.com/parts/KH-TYPE-C-16P/Kinghelm/view-part/?ref=eda; MF: kinghelm; MP: KH-TYPE-C-16P; PACKAGE: None; PRICE: None; SNAPEDA_LINK: https://www.snapeda.com/parts/KH-TYPE-C-16P/Kinghelm/view-part/?ref=snap
L1-L3 = InkTime_v5:NORDIC_NRF_2_INDUCTOR: Generic chip inductor
L5 = InkTime_v5:ESP32_C6_LIBRARY_2_744043680; COPYRIGHT: Copyright (C) 2024 Ultra Librarian. All rights reserved.; MANUFACTURER_PART_NUMBER: 744043680; MFR_NAME: Wurth Electronics
L7 = InkTime_v5:MLP2016SR47MT0S1_FTC252012SR47MBCA: SMD / SMT Inductors (Coils), L=0.47?H, L x W x T : Source: Datasheet <https://product.tdk.com/system/files/dam/doc/product/inductor/inductor/smd/catalog/inductor_commercial_power_mlp2016_en.pdf>; DESCRIPTION: SMD / SMT Inductors (Coils), L=0.47?H, L x W x T :; HEIGHT: 1mm; JLCPCB: https://jlcpcb.com/partdetail/6763488-FTC252012SR47MBCA/C5832368; MANUFACTURER_NAME: TDK; MANUFACTURER_PART_NUMBER: FTC252012SR47MBCA
Q1 = InkTime_v5:ESP32_C6_LIBRARY_4_ESP32_WROVER_SPARKFUN-DISCRETESEMI_MOSFET_PCH: P-channel MOSFETs Voltage controlled devices that allow control of high current outputs. SparkFun Products: SparkFun ESP32 Thing <https://www.sparkfun.com/products/13907> SparkFun ESP8266 Thing <https://www.sparkfun.com/products/13231> SparkFun Pi Servo HAT V2 <https://www.sparkfun.com/products/15316> DMG2305UX-7 (20V/4.2A/SOT23-3); PROD_ID: TRAN-14388
Q3 = InkTime_v5:ESP32_C6_LIBRARY_6_SI1308EDL-T1-GE3: MOSFET N-Ch 30V 1.5A TrenchFET SC70 Vishay Si1308EDL-T1-GE3 N-channel MOSFET Transistor, 1.5 A, 30 V, 3-Pin SC-70 Source: Datasheet <https://componentsearchengine.com/Datasheets/1/SI1308EDL-T1-GE3.pdf> Check availability <https://pricing.snapeda.com/parts/SI1308EDL-T1-GE3/Vishay%20Siliconix/view-part?ref=eda>; AVAILABILITY: In Stock; CHECK_PRICES: https://www.snapeda.com/parts/SI1308EDL-T1-GE3/Vishay+Siliconix/view-part/?ref=eda; DESCRIPTION: Si1308EDL-T1-GE3 N-channel MOSFET Transistor, 1.5 A, 30 V, 3-Pin SC-70 | Siliconix / Vishay SI1308EDL-T1-GE3; MF: Vishay Siliconix; MP: SI1308EDL-T1-GE3; PACKAGE: SOT-323 Vishay Semiconductor; PRICE: None; PURCHASE-URL: https://www.snapeda.com/api/url_track_click_mouser/?unipart_id=274603&manufacturer=Vishay Siliconix&part_name=SI1308EDL-T1-GE3&search_term=None; SNAPEDA_LINK: https://www.snapeda.com/parts/SI1308EDL-T1-GE3/Vishay+Siliconix/view-part/?ref=snap
R1_EP_DR R1_USB R2_EP_DR R2_USB R3 R5 R7 R8 R_PWR_EPD R_TYPE_SEL = InkTime_v5:CPF0201D7K68C1_CPF0201D7K68C1: 7.68k 0201 Thin Film Surface Mount Fixed Resistor +/-0.5% 0.031W CPF0201D7K68C1 Source: Datasheet <http://www.te.com/commerce/DocumentDelivery/DDEController?Action=showdoc&DocId=Data Sheet1773200-1ApdfEnglishENG_DS_1773200-1_A.pdf4-2176215-6>
R2 R4 R9 R17 R18 = InkTime_v5:ERA-1AEB3401C_CPF0201D7K68C1: 7.68k 0201 Thin Film Surface Mount Fixed Resistor +/-0.5% 0.031W CPF0201D7K68C1 Source: Datasheet <http://www.te.com/commerce/DocumentDelivery/DDEController?Action=showdoc&DocId=Data Sheet1773200-1ApdfEnglishENG_DS_1773200-1_A.pdf4-2176215-6>
SJ1 = InkTime_v5:ESP32_C6_LIBRARY_7_JUMPER_SJ: SMD solder JUMPER
SW1 SW_ENT SW_UP = InkTime_v5:2025-10-22_07-23-44_LIBRARY_EVP-AKE31A; COPYRIGHT: Copyright (C) 2025 Ultra Librarian. All rights reserved.; DIGI-KEY_PART_NUMBER_1: P123437TR-ND; DIGI-KEY_PART_NUMBER_2: P123437CT-ND; DIGI-KEY_PART_NUMBER_3: P123437DKR-ND; MANUFACTURER_NAME: Panasonic; MANUFACTURER_PART_NUMBER: EVP-AKE31A
TP_3.3V TP_3V3 TP_BAT_GND TP_GND TP_ON TP_OP TP_RESET TP_SCL TP_SDA TP_SWDCLK TP_SWDIO TP_SWO TP_VBAT TP_VREG = InkTime_v5:HECTOR_WATCH_1_TP: Test pad
U1 = InkTime_v5:NORDIC_NRF_4_NRF52840_QF: nRF52840 Features Advanced Single chip 2.4 GHz multi-protocol SoC 32-bit ARM Cortex-M4F Processor 1.7v to 5.5v operation 1MB flash + 256kB RAM Bluetooth 5 support for long range and high throughput 802.15.4 radio support On-chip NFC PPI –Programmable Peripheral Interconnect Automated power management system with automatic power management of each peripheral Configurable I/O mapping for analog and digital I/O 48 x GPIO 1 x QSPI 4 x Master/Slave SPI 2 x Two-wire interface (I²C) I²S interface 2 x UART 4 x PWM USB 2.0 controller ARM TrustZone CryptoCell-310 Cryptographic and security module AES 128-bit ECB/CCM/AAR hardware accelerator Digital microphone interface (PDM) Quadrature decoder 12-bit ADC Low power comparator On-chip 50Ω balun On-air compatible with nRF52, nRF51 and nRF24 Series Applications Advanced high performance wearables Wearables for secure payments Virtual Reality/Augmented Reality systems Smart Home sensor networks Smart city sensor networks High performance HID controllers Internet of Things (IoT) sensor networks Smart door locks Smart lighting networks Connected white goods
U3 = InkTime_v5:ESP32_C6_LIBRARY_MAX17048G+T10: Check availability <https://pricing.snapeda.com/parts/MAX17048G%2BT10/Analog%20Devices/view-part?ref=eda>; AVAILABILITY: In Stock; CHECK_PRICES: https://www.snapeda.com/parts/MAX17048G+T10/Analog+Devices/view-part/?ref=eda; DESCRIPTION: 3µA 1-Cell/2-Cell Fuel Gauge with ModelGauge; MF: Analog Devices; MP: MAX17048G+T10; PACKAGE: TDFN-8 Maxim; PRICE: None; PURCHASE-URL: https://www.snapeda.com/api/url_track_click_mouser/?unipart_id=329239&manufacturer=Analog Devices&part_name=MAX17048G+T10&search_term=None; SNAPEDA_LINK: https://www.snapeda.com/parts/MAX17048G+T10/Analog+Devices/view-part/?ref=snap
X1 = InkTime_v5:NORDIC_NRF_XTAL_32MHZ
X2 = InkTime_v5:NORDIC_NRF_1_XTAL_32KHZ

## Net classes
0 default: width 0.15 mm
1 POWER: width 0.15 mm

## Board
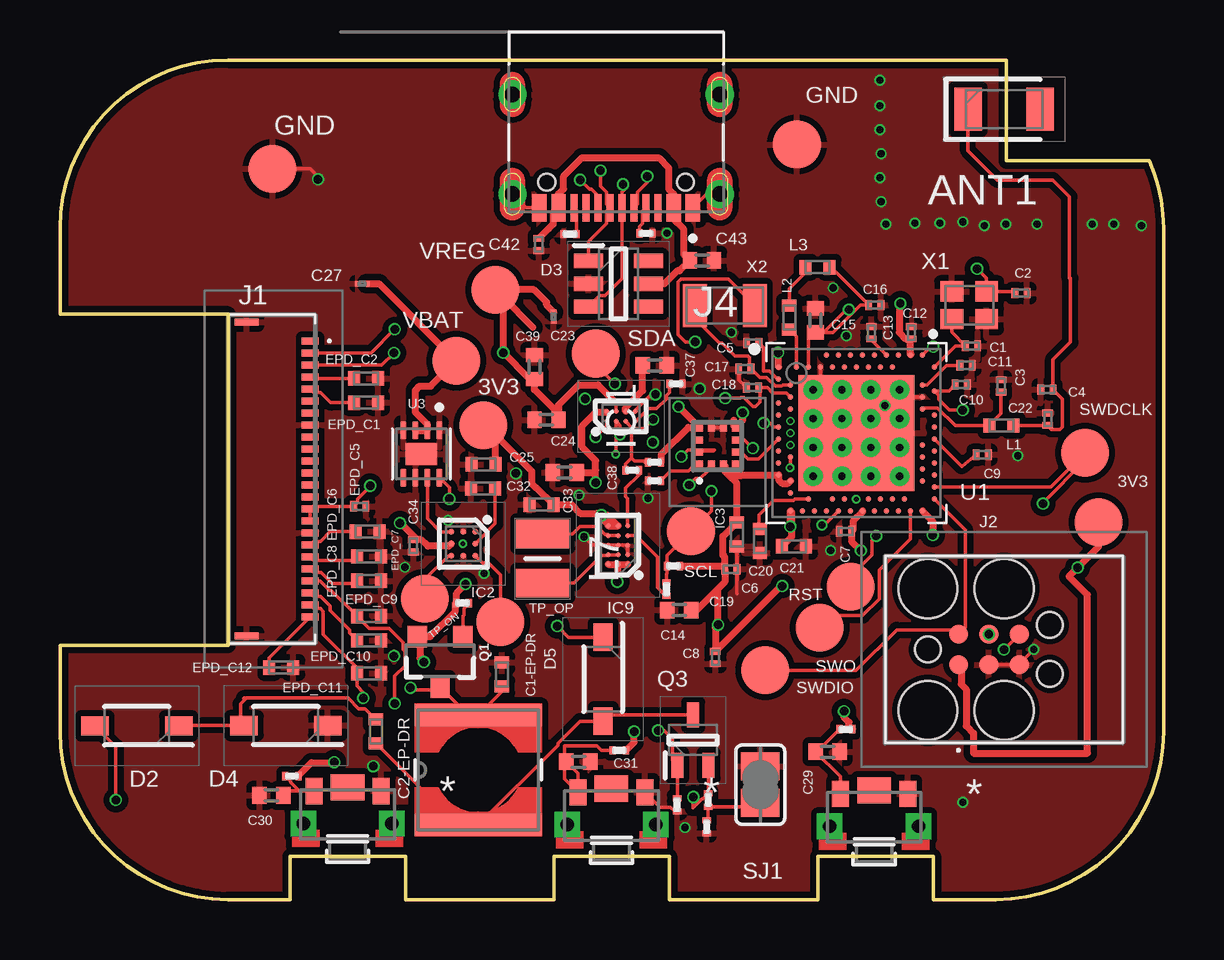
[diagram p2: board, top side]
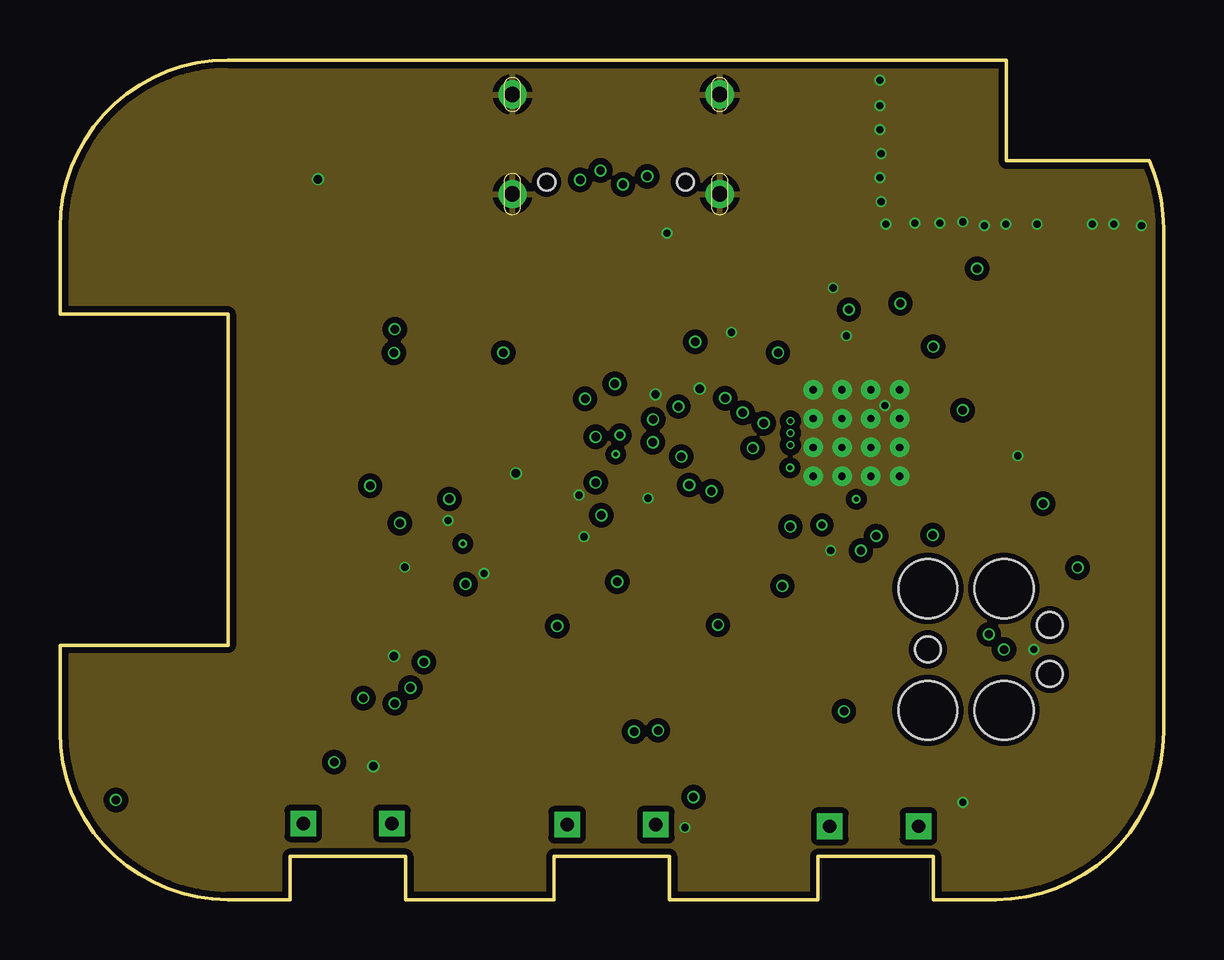
[diagram p3: board, inner layer Route2]
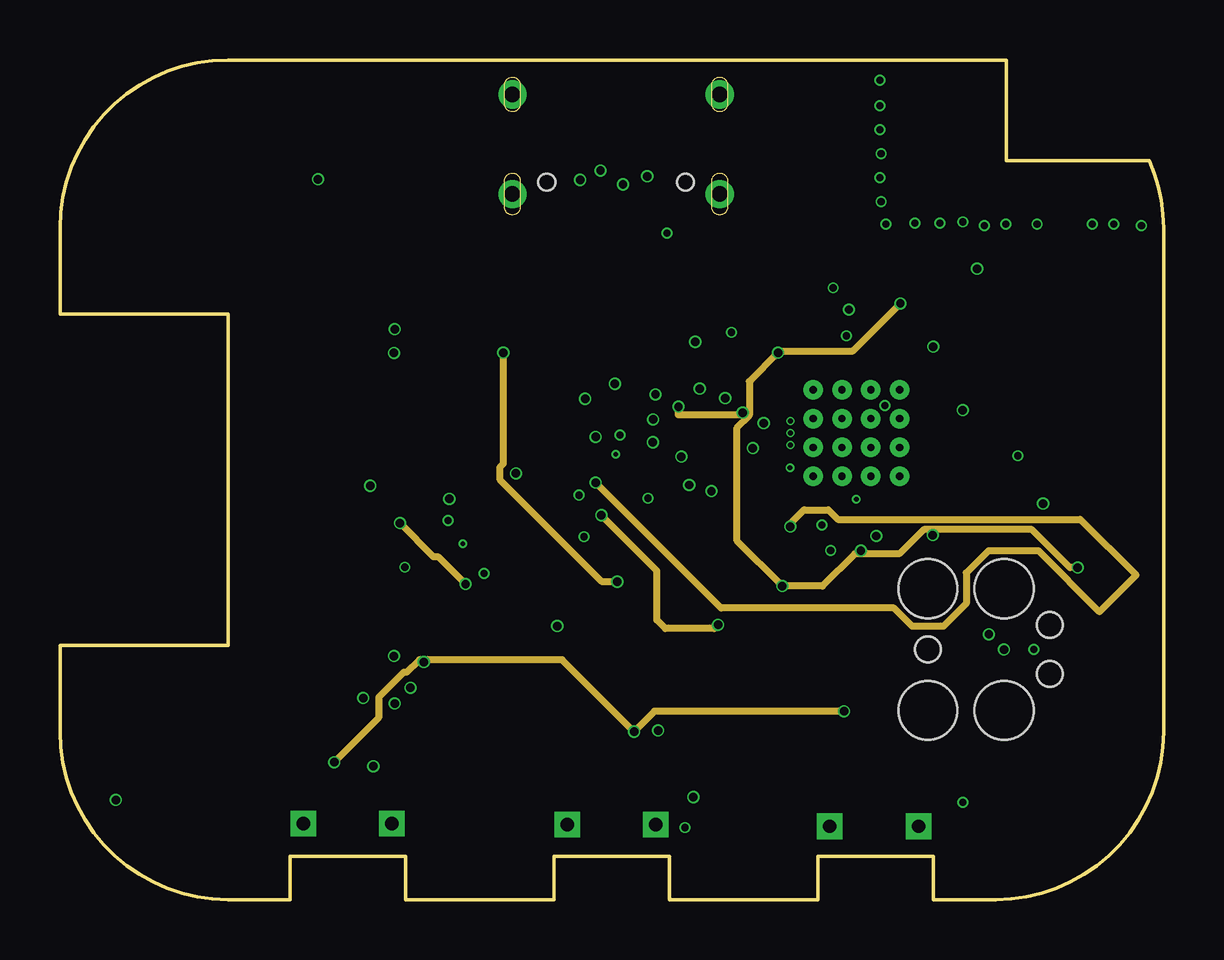
[diagram p4: board, inner layer Route15]
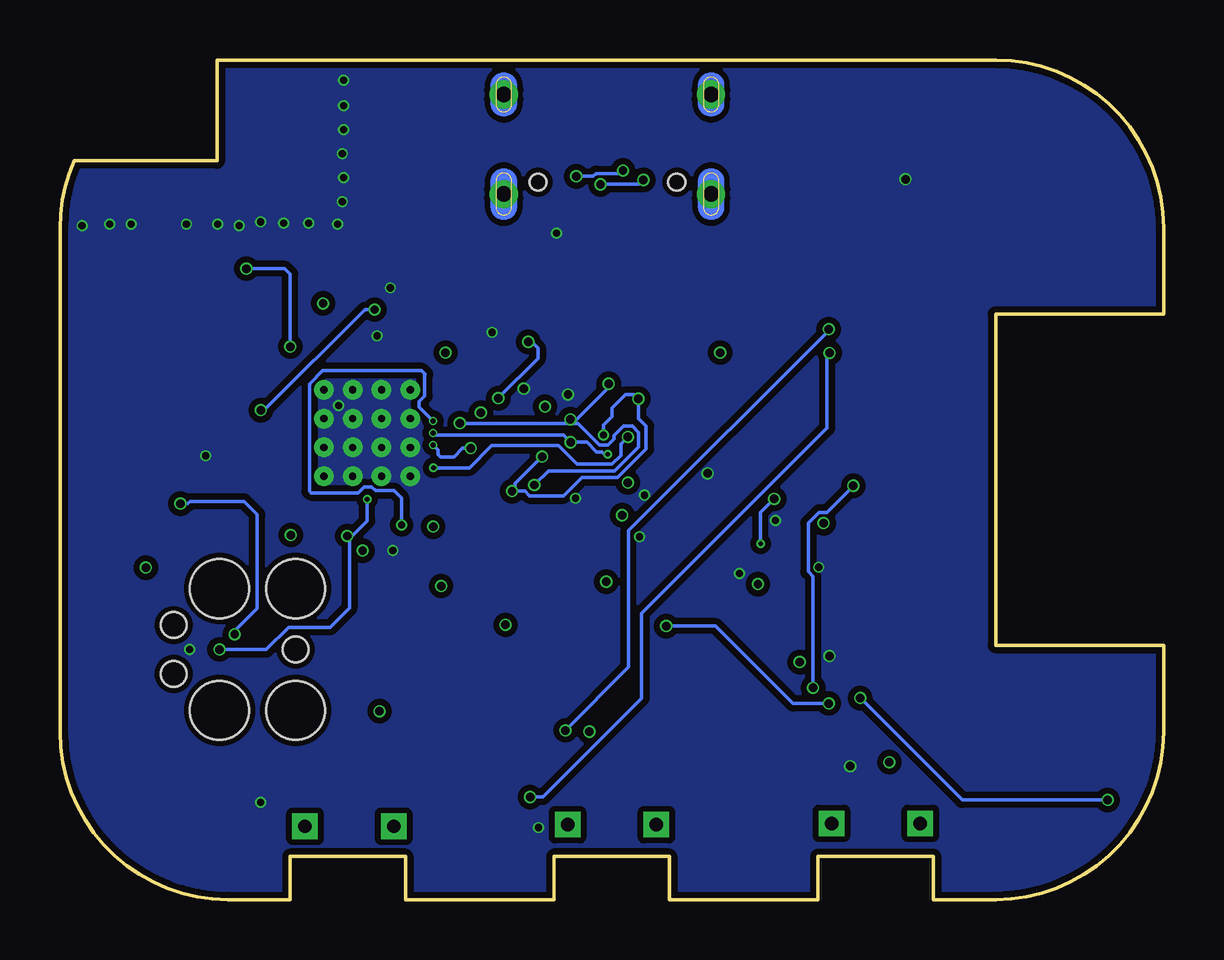
[diagram p5: board, bottom side, seen from below]

Size 46 x 35 mm. Coordinates in mm from the lower left corner, seen from the top.
Outline: 39,0 36.4,0 36.4,1.8 31.6,1.8 31.6,0 25.4,0 25.4,1.8 20.6,1.8 20.6,0 14.4,0 14.4,1.8 9.6,1.8 9.6,0 7,0 arc-90 0,7 0,10.6 7,10.6 7,24.4 0,24.4 0,28 arc-90 7,35 39,35 arc-4 39.45,34.99 39.45,30.8 45.42,30.8 arc-24 46,28 46,7 arc-90 39,0
Copper layers (1+2*15+16): Top 0.035mm / dielectric 1.6mm / Route2 0.035mm / dielectric 0.15mm / Route15 0.035mm / dielectric 0.2mm / Bottom 0.035mm
Design rules "jlcpcb-2layers.dru *": minimum track width 5mil, minimum drill 0.3mm, track to track 5mil, track to pad 5mil, pad to pad 5mil, via to via 5mil, smd to smd 5mil, copper to edge 0.2mm, drill to drill 6mil, minimum pad ring 10mil, minimum via ring 3mil, stop-mask expansion 4mil, vias tented up to drill 0mil, thermal gap 10mil

### Footprints (pad centres in the part's own frame; a part is rotated, then mirrored left to right if it is on the bottom)
2450AT18B100E_ANTC3216X140N = smd 1.15 x 1.8: 1 -1.5,0; 2 1.5,0
NORDIC_NRF_3_RESC0201_L = smd 0.28 x 0.43: 1 -0.255,0; 2 0.255,0
NORDIC_NRF_3_RESC0402_L = smd 0.5 x 0.6: 1 -0.5,0; 2 0.5,0
PERFECT_0402_0402 = smd 0.6 x 0.7: 1 -0.5,0; 2 0.5,0
GRM011R60J152KE01L_2_CAPC0201X13N = smd 0.22 x 0.23: 1 -0.185,0; 2 0.185,0
ESP32_C6_LIBRARY_5_SOD3716X135N = smd 1.15 x 0.8: 1 -1.75,0; 2 1.75,0
ESP32_C6_LIBRARY_3_SOT95P280X145-6N = smd 1.2 x 0.6: 1 -1.25,0.95; 2 -1.25,0; 3 -1.25,-0.95; 4 1.25,-0.95; 5 1.25,0; 6 1.25,0.95
BQ25180YBGR_BGA8C40P2X4_100X155X50 = smd 0.2 x 0.2: A1 -0.2,0.6; A2 0.2,0.6; B1 -0.2,0.2; B2 0.2,0.2; C1 -0.2,-0.2; C2 0.2,-0.2; D1 -0.2,-0.6; D2 0.2,-0.6
DRV2605YZFR_BGA9C50P3X3_144X144X62 = smd 0.25 x 0.25: A1 -0.5,0.5; A2 0,0.5; A3 0.5,0.5; B1 -0.5,0; B2 0,0; B3 0.5,0; C1 -0.5,-0.5; C2 0,-0.5; C3 0.5,-0.5
BMA423_BMA423 = smd 0.3 x 0.35: 1 -0.75,-0.775; 2 -0.25,-0.775; 3 0.25,-0.775; 4 0.75,-0.775; 7 0.75,0.775; 8 0.25,0.775; 9 -0.25,0.775; 10 -0.75,0.775 | smd 0.35 x 0.3: 5 0.775,-0.25; 6 0.775,0.25; 11 -0.775,0.25; 12 -0.775,-0.25
RT6160AWSC_BGA15C40P3X5_140X230X60 = smd 0.216 x 0.216: A1 -0.4,0.8; A2 0,0.8; A3 0.4,0.8; B1 -0.4,0.4; B2 0,0.4; B3 0.4,0.4; C1 -0.4,0; C2 0,0; C3 0.4,0; D1 -0.4,-0.4; D2 0,-0.4; D3 0.4,-0.4; E1 -0.4,-0.8; E2 0,-0.8; E3 0.4,-0.8
503480-2400_5034802400 = smd 0.3 x 0.7: 1 -5.75,1.525; 2 -5.25,1.525; 3 -4.75,1.525; 4 -4.25,1.525; 5 -3.75,1.525; 6 -3.25,1.525; 7 -2.75,1.525; 8 -2.25,1.525; 9 -1.75,1.525; 10 -1.25,1.525; 11 -0.75,1.525; 12 -0.25,1.525; 13 0.25,1.525; 14 0.75,1.525; 15 1.25,1.525; 16 1.75,1.525; 17 2.25,1.525; 18 2.75,1.525; 19 3.25,1.525; 20 3.75,1.525; 21 4.25,1.525; 22 4.75,1.525; 23 5.25,1.525; 24 5.75,1.525 | smd 0.3 x 1: MP1 -6.54,-1.125; MP2 6.54,-1.125
TC2030-IDC_TC2030IDC = smd 0.783 x 0.783: 1 -0.953,-0.635; 2 -0.953,0.635; 3 0.317,-0.635; 4 0.317,0.635; 5 1.588,-0.635; 6 1.588,0.635 | hole 2.451: -2.223,-2.54; -2.223,2.54; 0.952,-2.54; 0.952,2.54 | hole 1.067: -2.223,0; 2.857,-1.016; 2.857,1.016
KH-TYPE-C-16P_KINGHELM_KH-TYPE-C-16P = smd 0.6 x 1.15: A1_B12 -3.2,4.725; A4_B9 -2.4,4.725; A9_B4 2.4,4.725; A12_B1 3.2,4.725 | smd 0.3 x 1.15: A5 -1.25,4.725; A6 -0.25,4.725; A7 0.25,4.725; A8 1.25,4.725; B5 1.75,4.725; B6 0.75,4.725; B7 -0.75,4.725; B8 -1.75,4.725 | drill 0.65 pad 1.05: SH1 -4.32,0; SH2 4.32,0; SH3 -4.32,4.15; SH4 4.32,4.15 | hole 0.7: -2.89,3.65; 2.89,3.65
NORDIC_NRF_2_RESC0402_L = smd 0.5 x 0.6: 1 -0.5,0; 2 0.5,0
ESP32_C6_LIBRARY_2_IND_4828-WE-TPC_WRE = smd 0.9 x 5.3: 1 -2.286,0; 2 2.286,0
MLP2016SR47MT0S1_INDC2016X100N = smd 1.2 x 2.2: 1 -1.028,0; 2 1.028,0
ESP32_C6_LIBRARY_4_ESP32_C6_LIBRARY_4_ESP32_C6_LIBRARY_4_ESP32_C6_LIBRARY_4_ESP32_WROVER_SPARKFUN-DISCRETESEMI_SOT23-3 = smd 0.8 x 0.9: 1 -0.95,-1; 2 0.95,-1; 3 0,1.1
ESP32_C6_LIBRARY_6_SOT65P210X110-3N = smd 1.05 x 0.5: 1 -1.05,0.65; 2 -1.05,-0.65; 3 1.05,0
CPF0201D7K68C1_0201 = smd 0.35 x 0.25: 1 0,0.275; 2 0,-0.275
ERA-1AEB3401C_0201 = smd 0.35 x 0.25: 1 0,0.275; 2 0,-0.275
ESP32_C6_LIBRARY_7_JUMPER_SJ = smd 1.168 x 1.6: 1 -0.762,0; 2 0.762,0
2025-10-22_07-23-44_LIBRARY_SW_EVP-AKE31A_PAN = smd 0.711 x 1.092: 1 -1.4,-0.972; 2 1.4,-0.972 | drill 0.559 pad 0.914 square: 3 -1.848,0.381; 4 1.848,0.381 | smd 1.397 x 1.092: 5 0,-1.124
HECTOR_WATCH_1_TP20R = smd 2 x 2: TP 0,0
NORDIC_NRF_4_AQFN50P700X700X85_HS-74N = smd 4.85 x 4.85: P$74 0,0 | drill 0.3 pad 0.6: P$75 -1.8,1.8; P$76 -0.6,1.8; P$77 0.6,1.8; P$78 1.8,1.8; P$79 -1.8,0.6; P$80 -0.6,0.6; P$81 0.6,0.6; P$82 1.8,0.6; P$83 -1.8,-0.6; P$84 -0.6,-0.6; P$85 0.6,-0.6; P$86 1.8,-0.6; P$87 -1.8,-1.8; P$88 -0.6,-1.8; P$89 0.6,-1.8; P$90 1.8,-1.8 | smd 0.2 x 0.2: P$A8 -1.25,3.25; P$A10 -0.75,3.25; P$A12 -0.25,3.25; P$A14 0.25,3.25; P$A16 0.75,3.25; P$A18 1.25,3.25; P$A20 1.75,3.25; P$A22 2.25,3.25; P$A23 2.75,3.25; P$AA24 3.25,-2.25; P$AB2 -2.75,-2.5; P$AC5 -2,-2.75; P$AC9 -1,-2.75; P$AC11 -0.5,-2.75; P$AC13 0,-2.75; P$AC15 0.5,-2.75; P$AC17 1,-2.75; P$AC19 1.5,-2.75; P$AC21 2,-2.75; P$AC24 3.25,-2.75; P$AD2 -2.75,-3.25; P$AD4 -2.25,-3.25; P$AD6 -1.75,-3.25; P$AD8 -1.25,-3.25; P$AD10 -0.75,-3.25; P$AD12 -0.25,-3.25; P$AD14 0.25,-3.25; P$AD16 0.75,-3.25; P$AD18 1.25,-3.25; P$AD20 1.75,-3.25; P$AD22 2.25,-3.25; P$AD23 2.75,-3.25; P$B1 -3.25,2.75; P$B3 -2.5,2.75; P$B5 -2,2.75; P$B7 -1.5,2.75; P$B9 -1,2.75; P$B11 -0.5,2.75; P$B13 0,2.75; P$B15 0.5,2.75; P$B17 1,2.75; P$B19 1.5,2.75; P$B24 3.25,2.75; P$C1 -3.25,2.25; P$D2 -2.75,2; P$D23 2.75,2; P$E24 3.25,1.75; P$F2 -2.75,1.5; P$F23 2.75,1.5; P$G1 -3.25,1.25; P$H2 -2.75,1; P$H23 2.75,1; P$J1 -3.25,0.75; P$J24 3.25,0.75; P$K2 -2.75,0.5; P$L1 -3.25,0.25; P$L24 3.25,0.25; P$M2 -2.75,0; P$N1 -3.25,-0.25; P$N24 3.25,-0.25; P$P2 -2.75,-0.5; P$P23 2.75,-0.5; P$R1 -3.25,-0.75; P$R24 3.25,-0.75; P$T2 -2.75,-1; P$T23 2.75,-1; P$U1 -3.25,-1.25; P$U24 3.25,-1.25; P$V23 2.75,-1.5; P$W1 -3.25,-1.75; P$W24 3.25,-1.75; P$Y2 -2.75,-2; P$Y23 2.75,-2
ESP32_C6_LIBRARY_SON50P200X200X80-9N = smd 0.76 x 0.27: 1 -0.985,0.75; 2 -0.985,0.25; 3 -0.985,-0.25; 4 -0.985,-0.75; 5 0.985,-0.75; 6 0.985,-0.25; 7 0.985,0.25; 8 0.985,0.75 | smd 0.9 x 1.3: 9 0,0
NORDIC_NRF_BT-XTAL_2016_N = smd 0.95 x 0.85: 1 -0.725,-0.575; 2 0.725,-0.575; 3 0.725,0.575; 4 -0.725,0.575
NORDIC_NRF_1_XTAL_3215_N = smd 1 x 1.8: 1 -1.25,0; 2 1.25,0

### Placement (x,y rotation side)
ANT1  39.35,32.95 0 top
C1  38,23.08 0 top
C1-EP-DR  18.42,9.38 90 top
C2  40.06,25.28 0 top
C2-EP-DR  13.17,7 270 top
C3  39.23,21.41 90 top
C4  41.14,21.26 180 top
C5  28.88,23.2 180 top
C6  28.21,15.22 270 top
C7  32.74,15.35 180 top
C8  27.32,10.09 270 top
C9  38.44,18.54 0 top
C10  37.57,21.47 0 top
C11  37.76,22.27 0 top
C12  35.48,23.63 90 top
C13  33.82,23.63 90 top
C14  25.82,12.06 180 top
C15  31.49,24.14 90 top
C16  33.97,24.78 0 top
C17  28.55,22.12 0 top
C18  28.87,21.34 0 top
C19  27.97,13.77 0 top
C20  29.18,14.94 270 top
C21  30.6,14.72 0 top
C22  41.17,20.03 90 top
C23  20.58,24.3 270 top
C24  20.28,20 180 top
C25  17.66,18.14 180 top
C27  12.6,25.67 0 top
C29  32,6.16 0 top
C30  8.82,4.34 180 top
C31  21.61,5.75 0 top
C32  17.64,17.14 180 top
C33  20.07,16.46 180 top
C34  14.73,14.75 90 top
C37  24.79,22.27 0 top
C38  21.04,17.8 180 top
C39  19.78,22.2 90 top
C42  19.96,27.31 90 top
C43  26.76,26.64 0 top
D2  3.2,7.24 180 top
D3  23.28,25.67 0 top
D4  9.42,7.25 180 top
D5  22.64,9.19 270 top
EPD_C1  12.75,20.71 180 top
EPD_C2  12.75,21.72 180 top
EPD_C5  12.49,16.39 180 top
EPD_C6  12.83,15.34 180 top
EPD_C7  12.88,14.3 180 top
EPD_C8  12.88,13.28 180 top
EPD_C9  12.88,11.82 180 top
EPD_C10  12.88,10.8 180 top
EPD_C11  12.88,9.44 180 top
EPD_C12  9.22,9.67 180 top
IC1  23.38,20.14 90 top
IC2  16.81,14.83 270 top
IC3  27.41,18.9 0 top
IC9  23.26,14.77 180 top
J1  8.9,17.53 270 top
J2  38.4,10.42 0 top
J4  23.18,33.56 180 top
L1  39.25,19.76 0 top
L2  30.4,24.27 90 top
L3  31.57,26.36 0 top
L5  17.44,5.4 90 top
L7  20.12,14.22 90 top
Q1  15.85,9.96 180 top
Q3  26.39,6.65 90 top
R1_EP_DR  27.02,4.15 180 top
R1_USB  24.43,27.77 270 top
R2  23.86,17.9 90 top
R2_EP_DR  25.72,3.95 180 top
R2_USB  21.25,27.74 270 top
R3  24.78,17.46 90 top
R4  25.28,12.94 0 top
R5  9.66,5.15 90 top
R7  32.76,7.1 90 top
R8  23.31,6.22 90 top
R9  25.68,21.5 270 top
R17  25.58,13.9 270 top
R18  24.78,18.22 270 top
R_PWR_EPD  16.78,12.36 270 top
R_TYPE_SEL  26.96,3.03 180 top
SJ1  29.19,4.79 270 top
SW1  33.94,3.43 180 top
SW_ENT  22.99,3.5 180 top
SW_UP  11.99,3.55 180 top
TP_3.3V  43.3,15.73 0 top
TP_3V3  17.64,19.77 0 top
TP_BAT_GND  8.86,30.46 0 top
TP_GND  30.72,31.48 0 top
TP_ON  15.21,12.54 0 top
TP_OP  18.36,11.57 0 top
TP_RESET  32.96,13.04 0 top
TP_SCL  26.3,15.35 0 top
TP_SDA  22.33,22.76 0 top
TP_SWDCLK  42.72,18.62 0 top
TP_SWDIO  29.4,9.56 0 top
TP_SWO  31.66,11.33 0 top
TP_VBAT  16.51,22.45 0 top
TP_VREG  18.15,25.42 0 top
U1  33.2,19.45 0 top
U3  15.06,18.57 270 top
X1  37.9,24.77 0 top
X2  27.71,24.76 0 top

### Tracks (layer width: path | path; a pad name or v marks a point on that pad's centre or on a via)
3V3/1.7D  (via drill 0.35)
  Top 0.3: R5.2 9.96,5.16 9.96,5.19 10.47,5.7 11.43,5.7 v11.43,5.73 | R8.2 23.93,6.56 v23.93,7 | R7.2 32.89,7.24 32.89,7.39 32.68,7.6 v32.68,7.85 | IC2.C2 16.22,14.73 15.34,14.73 15.05,15 C34.2 14.83,15 14.86,14.98 14.86,15.04 14.21,15.69 v14.17,15.69 | v15.17,9.9 15,10.06 15,10.85 Q1.2 15.43,10.96 16.48,12.01 16.48,12.34 R_PWR_EPD.2 16.51,12.38 16.53,12.4 16.53,12.78 v16.9,13.15
  Route15 0.3: v16.9,13.15 15.75,14.3 15.56,14.3 v14.17,15.69 | 15.06,10 20.93,10 v23.93,7 24.78,7.85 v32.68,7.85 | v15.17,9.9 15.06,10 | 15.06,10 14.98,10 14.46,9.48 14.34,9.48 13.3,8.45 13.3,7.6 v11.43,5.73
3V3/2.4A  (via drill 0.35)
  Top 0.3: U1.P$Y2 30.35,17.35 30.1,17.35 29.95,17.5 U1.P$W1 28.44,17.7 28.42,17.68 27.89,17.68 | IC3.3 27.73,18.06 27.73,17.84 27.89,17.68 | 27.89,17.68 28.21,17.36 C6.1 27.63,15.14 27.63,14.35 27.71,14.27 C19.1 | 28.08,19.97 28.08,19.75 IC3.7 28.46,19.98 v28.46,20.29 | R18.1 25.06,18.55 26.19,19.68 IC3.10 v25.78,20.55 | v30.11,13.07 30.04,13.07 C8.1 27.32,11.34 v27.43,11.45 27.43,12.95 | 35.48,22.73 U1.P$A22 35.45,23.34 C12.1 35.25,23.38 34.98,23.64 34.98,24.85 v35.03,24.85 | v29.93,22.8 29.95,22.78 U1.P$B1 | R17.1 27.58,13.9 C19.1 | C25.1 18.16,19.25 TP_3V3.TP 17.75,19.78 19.66,17.86 19.66,17.33 19.82,17.17 19.85,17.17 C33.1 21.33,16.46 21.68,16.1 22.37,16.1 22.83,15.65 22.83,15.61 IC9.E3 IC9.E2 22.82,16.02 v22.57,16.02 | TP_3.3V.TP 43.3,14.72 v42.42,13.84 42.05,13.47 42.83,12.7 42.83,6.1 38.08,6.1 38.08,6.93 37.78,7.23 37.78,8.77 37.57,8.97 37.57,9.66 J2.1 | C19.1 27.71,13.23 27.43,12.95 | U1.P$AD14 33.45,16.17 33.06,15.78 33.06,15.42 C7.1 32.99,14.93 v33.38,14.54 | U1.P$AD23 36.38,15.77 v36.38,15.19 | C14.1 26.54,12.06 27.43,12.95
  Route15 0.3: v35.03,24.85 33.03,22.85 29.93,22.85 v29.93,22.8 28.73,21.6 28.73,20.2 | 33.36,14.41 34.99,14.41 36,15.42 36.38,15.42 | v27.43,11.45 27.28,11.3 25.23,11.3 24.88,11.65 24.88,13.71 v22.57,16.02 | 28.55,20.2 25.78,20.2 v25.78,20.55 | 33.36,14.41 33.38,14.43 v33.38,14.54 | 28.55,20.2 28.73,20.2 | 28.55,20.2 v28.46,20.29 | v42.42,13.84 42.1,13.84 40.51,15.42 36.38,15.42 | 28.73,20.2 28.73,20.18 28.23,19.67 28.23,14.95 v30.11,13.07 31.79,13.07 33.13,14.41 33.36,14.41 | 36.38,15.42 v36.38,15.19
DEC1
  Top 0.15: U1.P$C1 29.91,21.7 29.57,22.04 29.33,22.04 29.33,23 C5.1
DEC3
  Top 0.15: C11.1 36.95,22.27 36.13,21.45 U1.P$D23
DEC4_6  (via drill 0.35)
  Top 0.15: C10.1 37.04,21.2 U1.P$E24 36.63,21.02 36.63,20.83 37.06,20.4 v37.63,20.4 | U1.P$B5 31.2,23.35 C15.1 31.82,23.64 | L3.2 32.13,26.36 C16.1 33.36,24.78 32.22,23.64 31.82,23.64 | v32.89,24.59 32.77,24.59 31.82,23.64
  Bottom 0.15: v37.63,20.4 37.48,20.4 33.29,24.59 v32.89,24.59
DN  (via drill 0.35)
  Top 0.15: D3.1 22.03,27.43 22.78,28.18 22.78,28.69 J4.A7 22.78,28.98 22.78,29.5 22.53,29.75 v22.53,30.39 | J4.B7 24.08,28.98 24.08,29.5 24.48,29.9 v24.48,30.15
  Bottom 0.15: v24.48,30.15 23.77,30.15 23.65,30.27 22.66,30.27 v22.53,30.39
DP  (via drill 0.35)
  Top 0.15: D3.3 22.48,25.17 22.72,25.17 23.43,25.88 J4.A6 23.43,29.5 23.53,29.6 23.53,29.75 v23.47,29.81 | v21.68,30 22.07,29.61 22.16,29.61 22.43,29.35 J4.B6
  Bottom 0.15: v23.47,29.81 21.87,29.81 v21.68,30
EPD_3V3  (via drill 0.35)
  Top 0.15: J1.16 J1.15 10.53,16.39 EPD_C5.2 12.41,16.56 12.41,16.69 12.93,17.21 v12.93,17.25 | C1-EP-DR.1 18.42,8.67 L5.2 17.02,7.69 Q1.3 15.73,8.75 14.68,8.75 v14.61,8.83
  Bottom 0.15: v14.61,8.83 14.61,13.48 14.8,13.68 14.8,15.7 14.36,16.14 14.04,16.14 v12.93,17.25
EPD_CS/2.2D  (via drill 0.2 pad 0.2, 0.3)
  Top 0.15: U1.P$AD10 31.92,15.67 31.77,15.67 v31.77,15.62
  Bottom 0.15: U1.P$K2 30.79,20.29 30.79,20.3 31.03,20.54 31.03,20.76 30.79,21 30.79,21.89 30.78,21.9 30.93,22.05 35.05,22.05 35.6,21.5 35.6,17.02 35.53,16.95 33.58,16.95 33.33,17.2 33.01,17.2 32.85,17.04 32.07,17.04 31.77,16.73 v31.77,15.62
  other vias: 30.45,19.95
GDR  (via drill 0.35)
  Top 0.15: v24.93,7.05 25.18,7.05 25.53,6.7 25.53,5.8 Q3.1 25.73,4.24 R2_EP_DR.2 | v13.95,23.78 12.96,22.78 J1.2
  Bottom 0.15: v13.95,23.78 13.93,23.75 22.29,15.39 22.29,9.69 v24.93,7.05
GND  (via drill 0.3, 0.35)
  Top 0.15: IC3.8 IC3.9 | C18.1 28.3,21.66 C17.1 | C6.2 28.21,13.78 C19.2 28.22,12.74 | J4.A12_B1 19.43,28.84 J4.SH4 | J4.A1_B12 26.95,29.41 J4.SH3 | U1.P$F23 35.3,20.95 U1.P$78 | U1.P$B7 31.7,21.55 U1.P$75 | J2.3 J2.5 39.99,9.82 v40.6,10.43 | IC9.B1 IC9.C1 IC9.C2 IC9.C3 22.2,14.77 v21.85,15.12 | SW_ENT.1 25,3.85 25.45,3.85 25.63,3.68 R2_EP_DR.1 | U1.P$74 34.35,20.6 v34.38,20.6
  Top 0.152: TP_BAT_GND.TP 10.42,30.46 10.8,30.08 v10.75,30.03 | IC1.D2 23.98,20.4 24.64,21.06 v24.82,21.06
  other vias: 13.06,5.56 13.92,10.15 26.67,21.29 16.18,15.8 17.68,13.6 14.38,13.85 27.99,23.64 32.78,23.5 39.93,18.5 32.23,25.5 24.51,16.73 26.05,3 25.31,27.78 34.18,33.1 34.18,32.1 34.23,31.1 34.18,30.1 34.23,29.1 34.43,28.15 36.68,28.2 37.63,28.25 38.53,28.1 39.43,28.15 40.73,28.15 43.03,28.15 43.93,28.15 45.08,28.1 35.63,28.2 34.18,34.15 32.13,14.55 37.63,4.05 21.64,16.86 19.01,17.77
  pour Top (isolate 0.254): -7.87,-8.04 51.66,-8.04 51.66,42.61 -7.87,42.61
  pour Route2 (isolate 0.254): -2.74,-5.32 47.85,-5.32 47.85,38.42 -2.31,38.42 -2.59,38.33 -2.6,38.32 -2.61,38.32 -2.61,38.32 -2.62,38.32 -2.74,38.32
  pour Bottom (isolate 0.254): -3.84,-6.77 49.35,-6.77 49.35,40.02 -3.8,40.02 -3.76,39.95 -3.76,39.94 -3.75,39.93 -3.75,39.92 -3.74,39.92 -3.74,39.92 -3.74,39.9 -3.74,39.89 -3.74,39.89 -3.74,39.88 -3.75,39.87 -3.75,39.86 -3.75,39.86 -3.76,39.86 -3.76,39.85 -3.77,39.84 -3.77,39.84 -3.78,39.84 -3.79,39.83 -3.8,39.83 -3.8,39.82 -3.8,39.82 -3.82,39.82 -3.83,39.82 -3.83,39.82 -3.84,39.82
IMU_INT1
  Top 0.15: IC3.5 28.38,18.65 28.67,18.37 29.12,18.37 U1.P$N1
IMU_INT2  (via drill 0.2 pad 0.2, 0.35)
  Top 0.15: IC3.6 28.53,19.15 28.86,18.82 v28.88,18.82
  Bottom 0.15: U1.P$P2 30.44,18.96 30.23,18.75 30.23,18.55 30.13,18.45 29.58,18.45 29.21,18.82 v28.88,18.82
  other vias: 30.45,18.95
LX1
  Top 0.15: IC9.B2 IC9.B3 22.82,14.33 22.58,14.33 21.44,13.19 L7.1
LX2
  Top 0.15: IC9.D2 IC9.D3 22.81,15.22 22.72,15.22 22.39,15.55 21.67,15.55 21.36,15.24 L7.2
N$1
  Top 0.15: IC1.D1 24.01,19.94 24.54,20.47 24.87,20.47 25.27,20.87 25.27,21.01 25.41,21.14 R9.2
N$2
  Top 0.15: IC9.D1 24.01,15.17 24.9,14.28 24.9,13.01 25.24,12.67 R4.2
N$3
  Top 0.15: IC9.E1 23.66,16.72 23.58,16.8 23.58,17.15 24.13,17.71 R2.2
N$4
  Top 0.15: L2.2 30.4,25.47 31.07,26.14 L3.1
N$6
  Top 0.15: L2.1 30.7,23.47 U1.P$B3
N$7
  Top 0.15: IC3.1 26.46,18.13 26.19,17.86 25.45,17.86 R3.2
N$9
  Top 0.15: C13.1 33.82,23.32 U1.P$A18
N$10
  Top 0.15: U1.P$D2 30.12,21.45 30.07,21.4 29.82,21.4 29.46,21.76 29.18,21.76 C17.2 28.73,22.2 28.73,22.59 28.67,22.65 28.14,22.65 27.59,23.2 27.48,23.2 26.46,24.22 X2.1
N$11  (via drill 0.35)
  Top 0.15: U1.P$F2 30.28,21.12 29.71,21.12 29.48,21.34 C18.2 29.18,21.29 29.18,20.75 28.98,20.55 28.88,20.55 28.5,20.93 28.39,20.93 28.36,20.9 v27.73,20.9 | X2.2 27.86,25.86 25.88,25.86 25.76,25.74 25.76,23.56 26.07,23.25 v26.48,23.25
  Bottom 0.15: v27.73,20.9 26.08,22.55 26.08,23 26.33,23.25 v26.48,23.25
N$12
  Top 0.152: C20.1 29.13,15.49 29.13,16.03 29.74,16.64 30.57,16.64 30.63,16.7 U1.P$AC5
N$14
  Top 0.15: U1.P$B24 37.33,23.08 C1.1 37.17,23.65 X1.1
N$15  (via drill 0.35)
  Top 0.15: C2.1 39.73,25.35 X1.3 38.62,25.91 v38.23,26.3 | U1.P$A23 36.3,23.05 v36.4,23.05
  Bottom 0.15: v36.4,23.05 36.4,26.07 36.63,26.3 v38.23,26.3
N$16
  Top 0.15: C9.1 37.59,18.06 U1.P$N24
N$17
  Top 0.15: L1.1 38.73,19.76 | C3.1 39.23,20.25 38.73,19.76 | 38.73,19.76 37.31,19.76 36.57,20.5 36,20.5 U1.P$H23
N$18
  Top 0.15: L1.2 41.16,19.76 | 41.16,19.76 C22.1 | 41.16,19.76 41.32,19.6 41.68,19.6 41.78,19.7 41.78,20.87 C4.1 41.39,22.51 42.12,23.23 42.12,25.9 42.08,25.9 42.08,29.3 41.38,30 39.08,30 37.85,31.23 ANT1.1
N$19
  Top 0.15: D4.2 7.53,7.25 | 7.53,7.25 4.96,7.25 D2.1 | 7.78,8.4 7.68,8.4 7.67,8.39 | 7.78,8.4 7.53,8.15 7.53,7.25 | C2-EP-DR.1 12.72,7.95 12.46,7.95 12,8.4 7.78,8.4
N$20
  Top 0.15: C2-EP-DR.2 16.55,3.11 L5.1 20.75,6.43 20.75,6.52 21.68,7.44 D5.2 22.9,7.7 Q3.3
N$21
  Top 0.15: R_TYPE_SEL.2 27.02,3.38 R1_EP_DR.1 29.04,3.87 SJ1.2
N$22
  Top 0.15: EPD_C2.2 10.48,21.72 J1.4
N$23
  Top 0.15: J1.5 10.57,21.14 10.86,21.14 11.29,20.71 EPD_C1.2
N$24
  Top 0.15: J1.18 10.57,14.93 10.86,14.93 11.27,15.34 EPD_C6.2
N$25
  Top 0.15: J1.19 10.57,14.14 12.21,14.14 EPD_C7.2
N$26
  Top 0.15: J1.20 10.57,13.64 10.89,13.64 11.35,13.17 12.27,13.17 EPD_C8.2
N$27
  Top 0.15: IC2.A2 17.49,15.01 17.49,15.02 18.14,15.67 C32.1
N$28
  Top 0.15: J1.22 10.57,12.64 10.86,12.64 11.25,12.24 11.25,12.06 12.08,11.24 12.08,11.11 EPD_C10.2
N$29
  Top 0.15: R2_USB.1 21.53,28.74 J4.B5
N$30
  Top 0.15: EPD_C12.2 8.72,10.08 J1.24
N$31
  Top 0.15: J4.A5 24.28,28.69 24.28,28.18 24.15,28.05 R1_USB.2
OUT+
  Top 0.15: IC2.A3 17.62,14.03 17.86,14.03 18.36,13.53 TP_OP.TP
OUT-
  Top 0.15: IC2.C3 16.2,14.33 15.2,13.34 TP_ON.TP
P0.13/1.5D
  Top 0.15: C30.1 9.51,4.52 SW_UP.2 9.98,4.52 9.61,4.89 9.61,4.92 R5.1
P0.14/1.5D
  Top 0.15: C31.1 21.59,5.27 SW_ENT.2 21.03,5.03 21.03,6.4 22.39,6.4 22.57,6.22 R8.1
P1.01/1.6C
  Top 0.15: R_PWR_EPD.1 16.83,12.14 16.83,11.86 16.8,11.83 Q1.1
P1.02/1.6C
  Top 0.15: SW1.2 32.54,5.13 C29.1 31.55,6.16 R7.1
PMIC_INT  (via drill 0.2, 0.35)
  Top 0.15: U1.P$T2 30.45,18.02 v30.43,18 | IC1.A1 22.78,19.74 v22.33,19.29
  Bottom 0.15: v30.43,18 28.93,18 28.01,18.92 25.21,18.92 24.44,18.15 22.99,18.15 22.62,18.52 22.62,19 v22.33,19.29
PREVGH  (via drill 0.35)
  Top 0.15: D5.1 21.19,10.94 v20.73,11.4 | v13.95,8.17 13.95,9.31 14.38,9.73 14.38,10.35 14.29,10.43 14.29,10.72 13.71,11.31 12.89,11.31 EPD_C9.2 11.3,12.89 11.24,12.89 10.85,13.28 J1.21
  Bottom 0.15: v20.73,11.4 18.67,11.4 15.45,8.17 v13.95,8.17
PREVGL  (via drill 0.35)
  Top 0.15: J1.23 10.57,12.14 10.86,12.14 10.98,12.02 10.98,11.05 12.38,9.65 EPD_C11.2 12.38,8.9 12.64,8.64 v12.64,8.4 | D2.2 2.33,6.37 v2.33,4.15
  Bottom 0.15: v2.33,4.15 8.39,4.15 v12.64,8.4
RESE  (via drill 0.35)
  Top 0.15: Q3.2 27.03,4.44 R1_EP_DR.2 26.8,4.2 26.76,4.2 26.38,3.82 26.38,4.25 v26.4,4.27 | J1.3 13.41,22.28 v13.92,22.79
  Bottom 0.15: v13.92,22.79 14.03,22.68 14.03,19.65 21.75,11.93 21.75,8.39 25.87,4.27 v26.4,4.27
RESET  (via drill 0.2, 0.35)
  Top 0.152: J2.6 v39.35,10.42 | v34.02,15.16 33.84,14.97 33.84,14.36 32.96,13.48 TP_RESET.TP
  Top 0.3: U1.P$AC13 v33.2,16.69
  Bottom 0.152: 33.93,15.05 33.93,12.15 34.73,11.35 36.48,11.35 37.4,10.42 | 33.93,15.05 33.93,15.06 v34.02,15.16 | v33.2,16.69 33.2,15.78 33.93,15.05 | 37.4,10.42 | v39.35,10.42 37.4,10.42
SCL/1.4C
  Top 0.15: IC2.C1 15.86,15.33 15.31,15.88 U3.7
SCL/2.4C  (via drill 0.2 pad 0.2, 0.3 pad 0.2, 0.35)
  Top 0.15: IC3.12 26.68,18.7 27.23,18.7 27.28,18.75 26.19,18.75 v25.9,18.46 | v27.16,17.03 27.16,16.2 TP_SCL.TP 25.3,14.34 R17.2 25.3,13.59 25.28,13.56 R4.1 | IC1.B1 | IC1.B1 23.28,19.84 23.28,19.82 23.34,19.76 v23.34,19.37 | IC1.B1 23.18,18.58 v23.16,18.56
  Bottom 0.15: v25.9,18.46 27.03,17.33 27.03,17.15 v27.16,17.03 26.61,17.03 26.42,16.83 25.01,16.83 24.25,17.59 22.76,17.59 21.57,18.79 21.57,19.73 21.89,20.06 v21.89,20.88 22.06,21.05 22.43,21.05 22.98,20.5 22.98,20.14 23.34,19.78 v23.34,19.37 | U1.P$M2 30.37,19.37 25.02,19.37 v24.71,19.06 24.03,19.06 23.63,18.66 23.41,18.66 23.31,18.56 v23.16,18.56
  other vias: 30.45,19.45
SDA/1.4C  (via drill 0.2, 0.35)
  Top 0.15: U3.8 16.23,17.17 v16.23,16.7 | IC2.B2 v16.79,14.83 | v16.79,14.83
  Bottom 0.15: v16.23,16.7 16.79,16.14 v16.79,14.83
SDA/2.4C  (via drill 0.35)
  Top 0.15: 24.49,18.24 R18.2 24.39,18.22 24.34,18.28 23.95,18.28 23.82,18.41 | v23.13,21.5 22.32,22.31 TP_SDA.TP | IC3.2 27.01,17.98 27.01,17.87 26.69,17.55 26.5,17.55 v26.23,17.28 | 23.82,19.68 23.86,19.64 24.35,19.64 v24.73,20.02 | U1.P$L1 29.75,19.7 29.59,19.86 v29.33,19.86 29.39,19.8 | 23.82,19.68 23.68,19.82 23.68,19.85 IC1.C1 | 23.82,18.41 23.82,19.68 | R2.1 23.58,18.16 23.82,18.41
  Bottom 0.15: v23.13,21.5 23.13,21.35 24.64,19.84 | 24.64,19.84 24.73,19.84 | 24.73,19.84 v24.73,20.02 | v26.23,17.28 25.64,17.87 22.88,17.87 21.88,18.87 21.88,19.48 22.14,19.74 22.52,19.74 22.91,19.35 22.91,19.19 23.16,18.94 23.52,18.94 24.41,19.84 24.64,19.84 | 24.73,19.84 29.32,19.84 v29.33,19.86
SWDCLK  (via drill 0.35)
  Top 0.152: U1.P$AA24 41.3,17.2 TP_SWDCLK.TP 42.72,18.29 40.98,16.55 v40.98,16.5
  Bottom 0.152: J2.4 38.72,11.21 37.78,12.15 37.78,16.05 38.33,16.6 40.57,16.6 40.67,16.5 v40.98,16.5
  other vias: 38.72,11.06
SWDIO
  Top 0.152: U1.P$AC24 37.73,15.42 37.73,11.34 J2.2 37.26,11.25 34.88,11.25 33.19,9.56 TP_SWDIO.TP
SWO
  Top 0.152: U1.P$AD22 35.45,15.03 34.16,13.74 34.16,12.54 33.46,11.83 32.16,11.83 TP_SWO.TP
VBAT/1.2A
  Top 0.3: 16.49,22.44 TP_VBAT.TP 13.3,25.67 C27.2 | U3.3 U3.2 15.31,19.81 14.81,20.31 14.81,21.23 14.98,21.4 15.46,21.4 16.49,22.44 | 16.12,22.44 16.49,22.44
VBAT/2.5C
  Top 0.3: IC1.C2 23.58,20.5 24.29,21.21 C37.1
VBUS/1.5D
  Top 0.3: D3.5 25.19,25.67 25.73,26.21 25.83,26.21 C43.1 26.01,26.89 26.01,27.94 25.58,28.37 J4.A4_B9 25.58,29.41 25.37,29.62 25.37,30.51 24.96,30.92 21.75,30.92 20.99,30.16 20.99,29.62 20.78,29.41 J4.A9_B4 20.56,28.61 20.56,28.15 20.37,27.96 C42.2
VBUS/2.6D  (via drill 0.35)
  Top 0.15: 22.76,20.32 IC1.A2
  Top 0.3: 22.76,20.32 22.34,20.32 21.77,19.75 21.77,18.86 22.33,18.3 22.33,17.9 | 30.5,15.6 v30.44,15.55 U1.P$AD2 30.5,16.15 30.5,15.6 | 30.5,15.6 30.5,15.12 C21.1 | 21.74,17.8 C38.1 22.23,17.8 22.33,17.9 | v22.33,17.38 22.33,17.9
  Route15 0.3: v30.44,15.55 30.44,15.68 31.01,16.25 32.03,16.25 32.42,15.85 42.53,15.85 44.86,13.53 43.33,12 40.79,14.54 38.7,14.54 37.78,13.61 37.78,12.33 36.83,11.39 35.53,11.39 34.76,12.15 27.56,12.15 v22.33,17.38
VREG  (via drill 0.35)
  Top 0.15: 23.18,20.7 IC1.B2
  Top 0.3: IC9.A3 IC9.A2 | IC9.A2 IC9.A1 | 19.72,23.85 18.48,25.09 | IC9.A2 23.23,13.94 v23.23,13.25 | 18.48,25.09 v18.48,22.8 19.58,21.7 C39.1 19.78,21.26 20.78,20.26 C24.1 20.78,20.61 21.62,21.45 22.43,21.45 23.18,20.7 | 18.48,25.09 TP_VREG.TP | 18.81,25.42 TP_VREG.TP | TP_VREG.TP 19.76,25.42 20.28,24.9 20.28,24.78 C23.1
  Route15 0.3: v18.48,22.8 18.48,18.17 18.35,18.04 18.35,17.5 22.6,13.25 v23.23,13.25
(copper drawn outside any net)
  shapes: Bottom area x1, Top area x1

### Text on the board
tPlace: GND | GND | VREG | VBAT | SDA | 3V3 | SWDCLK | 3V3 | SCL | RST | SWO | SWDIO